# Altium project Ixora.PrjPCB (part 2 of 3)

## Sheet RGB_Display.SchDoc: Ixora
size A3; Organization: Toradex AG; Address1: Altsagenstrasse 5; Address2: Horw; Address3: 6048; Address4: Switzerland; DocumentNumber: 12; Revision: V1.1; SheetNumber: 12; SheetTotal: 19; PageSetup: Record=PageOptions|CenterHorizontal=True|CenterVertical=True|PrintScale=0.73|XCorrection=1.00|YCorrection=1.00|PrintKind=0|BorderSize=5000000|LeftOffset=0|BottomOffset=0|Orientation=2|PaperLength=1000|PaperWidth=1000|Scale=100|PaperSource=7|PrintQuality=-4|MediaType=1|DitherType=10|PaperKind=A4|PrintScaleMode=1
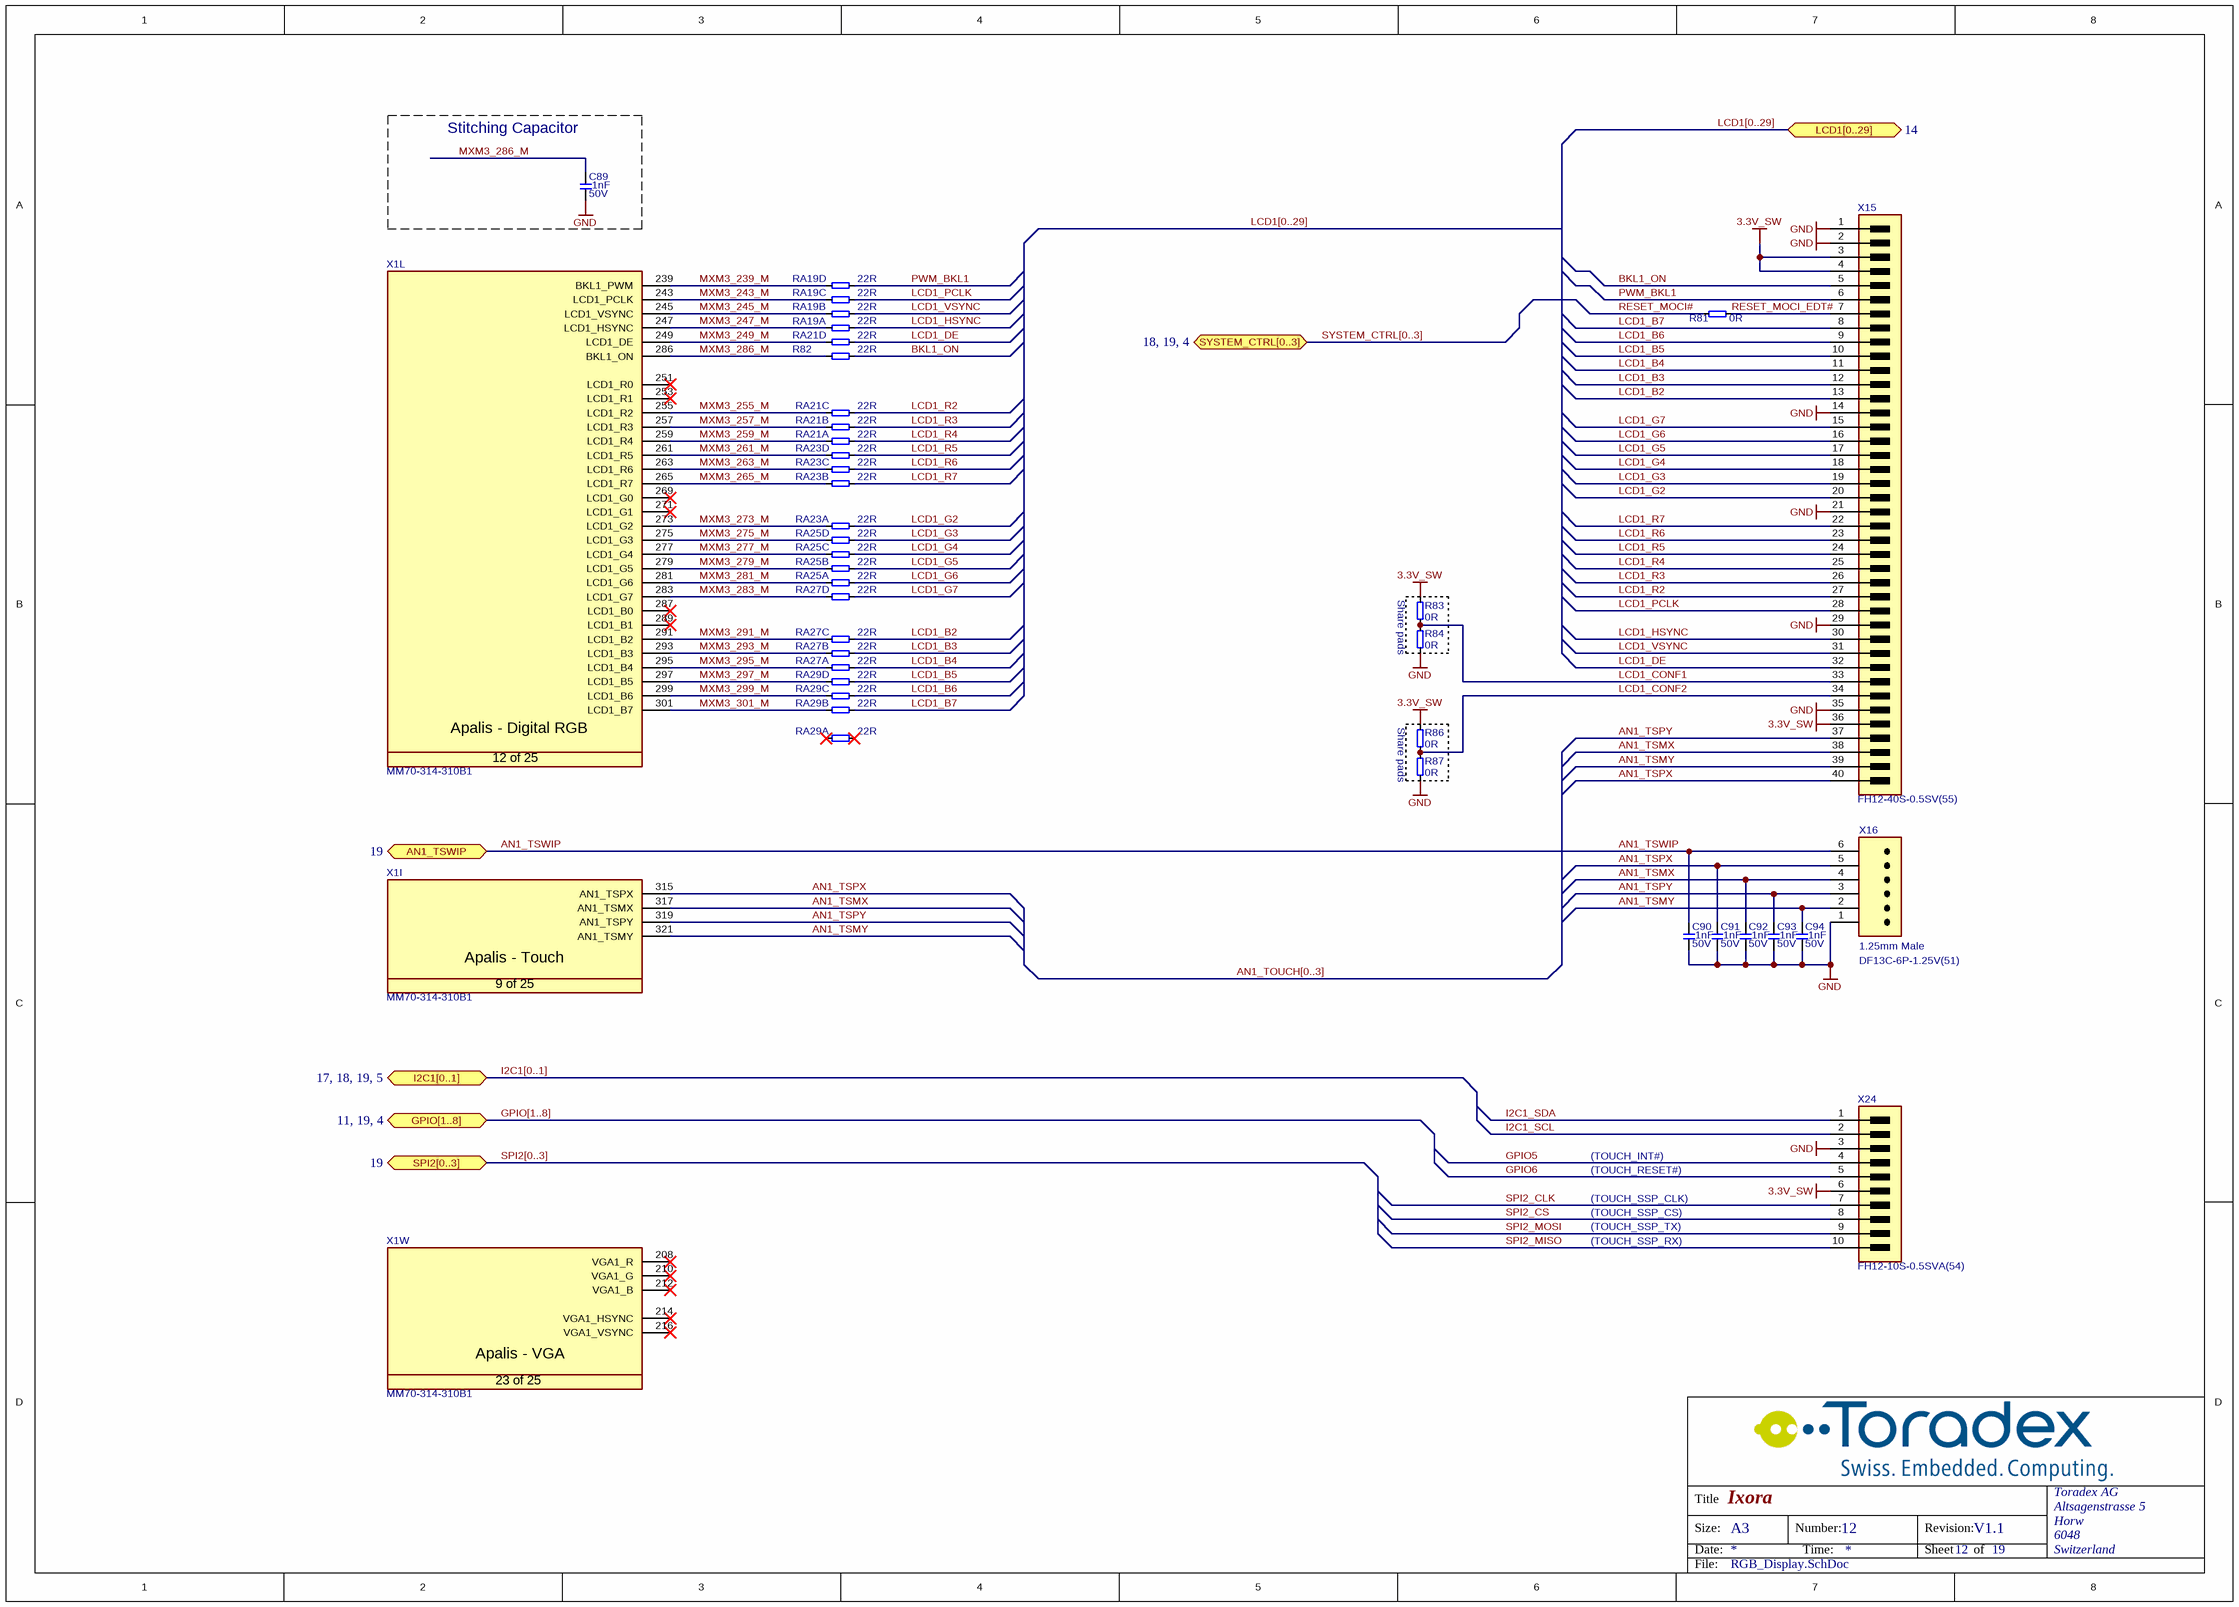
[diagram p7: RGB_Display.SchDoc]

### Parts
C89  Rating: 50V  [CAPC1005X60N]  (hidden comment: 1nF)
C90  Rating: 50V  [CAPC1005X60N]  (hidden comment: 1nF)
C91  Rating: 50V  [CAPC1005X60N]  (hidden comment: 1nF)
C92  Rating: 50V  [CAPC1005X60N]  (hidden comment: 1nF)
C93  Rating: 50V  [CAPC1005X60N]  (hidden comment: 1nF)
C94  Rating: 50V  [CAPC1005X60N]  (hidden comment: 1nF)
R81  0R  [RESC1005X40N]
R82  22R  [RESC1005X40N]
R83  0R  [T_RESC0603X30N]
R84  0R  [T_RESC0603X30N]
R86  0R  [T_RESC0603X30N]
R87  0R  [T_RESC0603X30N]
RA19  22R  [T_Resistor_Array_X4]  (parts A,B,C,D of 4)
RA21  22R  [T_Resistor_Array_X4]  (parts A,B,C,D of 4)
RA23  22R  [T_Resistor_Array_X4]  (parts A,B,C,D of 4)
RA25  22R  [T_Resistor_Array_X4]  (parts A,B,C,D of 4)
RA27  22R  [T_Resistor_Array_X4]  (parts A,B,C,D of 4)
RA29  22R  [T_Resistor_Array_X4]  (parts A,B,C,D of 4)
X1  Manufacturer Part No.: MM70-314-310B1  [T_JAE_MM70-314-310B1]  (hidden comment: CON-JAE-MM70-314-310B1-314-0.5mm)  (parts I,L,W of 25)
X15  FH12-40S-0.5SV(55)  [T_Hirose_FH12-40S-0.5SV(55)]
X16  DF13C-6P-1.25V(51)  [T_HIROSE_DF13C-6P-1.25V(51)]
X24  FH12-10S-0.5SVA(54)  [T_Hirose_FH12-10S-0.5SVA(54)]

### Blocks framed on the sheet
Stitching Capacitor: C89

### Ports
AN1_TSWIP (bidir, see 19), GPIO[1..8] (bidir, see 11, 19, 4), I2C1[0..1] (bidir, see 17, 18, 19, 5), LCD1[0..29] (bidir, see 14), SPI2[0..3] (bidir, see 19), SYSTEM_CTRL[0..3] (bidir, see 18, 19, 4)

### Nets
3.3V_SW: R83.1 R86.1 X15.3(VCC) X15.4(VCC) X15.36(VDD) X24.6(TMDS_DATA0_N)
GND: C89.1 C90.1 C91.1 C92.1 C93.1 C94.1 R84.2 R87.1 X15.1(VSS) X15.2(VSS) X15.14(VSS) X15.21(VSS) X15.29(VSS) X15.35(VSS) X16.1(GND) X24.3(TMDS_CLK_N)
AN1_TSMX: C92.2 X1.317(AN1_TSMX) X15.38(XR) X16.4(TSMX)
AN1_TSMY: C94.2 X1.321(AN1_TSMY) X15.39(YD) X16.2(TSMY)
AN1_TSPX: C91.2 X1.315(AN1_TSPX) X15.40(XL) X16.5(TSPX)
AN1_TSPY: C93.2 X1.319(AN1_TSPY) X15.37(YU) X16.3(TSPY)
AN1_TSWIP: C90.2 X16.6(WIPER) ; port AN1_TSWIP
BKL1_ON: R82.2 X15.5(PWCTRL)
GPIO5: X24.4(GND)
GPIO6: X24.5(TMDS_DATA0_P)
I2C1_SCL: X24.2(TMDS_CLK_P)
I2C1_SDA: X24.1(GND)
LCD1_B2: RA27.7 X15.13(B0)
LCD1_B3: RA27.6 X15.12(B1)
LCD1_B4: RA27.5 X15.11(B2)
LCD1_B5: RA29.8 X15.10(B3)
LCD1_B6: RA29.7 X15.9(B4)
LCD1_B7: RA29.6 X15.8(B5)
LCD1_CONF1: R83.2 R84.1 X15.33(NC)
LCD1_CONF2: R86.2 R87.2 X15.34(SHUT)
LCD1_DE: RA21.8 X15.32(ENB)
LCD1_G2: RA23.5 X15.20(G0)
LCD1_G3: RA25.8 X15.19(G1)
LCD1_G4: RA25.7 X15.18(G2)
LCD1_G5: RA25.6 X15.17(G3)
LCD1_G6: RA25.5 X15.16(G4)
LCD1_G7: RA27.8 X15.15(G5)
LCD1_HSYNC: RA19.5 X15.30(HSYNC)
LCD1_PCLK: RA19.7 X15.28(DCLK)
LCD1_R2: RA21.7 X15.27(R0)
LCD1_R3: RA21.6 X15.26(R1)
LCD1_R4: RA21.5 X15.25(R2)
LCD1_R5: RA23.8 X15.24(R3)
LCD1_R6: RA23.7 X15.23(R4)
LCD1_R7: RA23.6 X15.22(R5)
LCD1_VSYNC: RA19.6 X15.31(VSYNC)
MXM3_239_M: RA19.4 X1.239(BKL1_PWM)
MXM3_243_M: RA19.3 X1.243(LCD1_PCLK)
MXM3_245_M: RA19.2 X1.245(LCD1_VSYNC)
MXM3_247_M: RA19.1 X1.247(LCD1_HSYNC)
MXM3_249_M: RA21.4 X1.249(LCD1_DE)
MXM3_255_M: RA21.3 X1.255(LCD1_R2)
MXM3_257_M: RA21.2 X1.257(LCD1_R3)
MXM3_259_M: RA21.1 X1.259(LCD1_R4)
MXM3_261_M: RA23.4 X1.261(LCD1_R5)
MXM3_263_M: RA23.3 X1.263(LCD1_R6)
MXM3_265_M: RA23.2 X1.265(LCD1_R7)
MXM3_273_M: RA23.1 X1.273(LCD1_G2)
MXM3_275_M: RA25.4 X1.275(LCD1_G3)
MXM3_277_M: RA25.3 X1.277(LCD1_G4)
MXM3_279_M: RA25.2 X1.279(LCD1_G5)
MXM3_281_M: RA25.1 X1.281(LCD1_G6)
MXM3_283_M: RA27.4 X1.283(LCD1_G7)
MXM3_286_M: C89.2 R82.1 X1.286(BKL1_ON)
MXM3_291_M: RA27.3 X1.291(LCD1_B2)
MXM3_293_M: RA27.2 X1.293(LCD1_B3)
MXM3_295_M: RA27.1 X1.295(LCD1_B4)
MXM3_297_M: RA29.4 X1.297(LCD1_B5)
MXM3_299_M: RA29.3 X1.299(LCD1_B6)
MXM3_301_M: RA29.2 X1.301(LCD1_B7)
PWM_BKL1: RA19.8 X15.6(LEDCTRL)
RESET_MOCI#: R81.1
RESET_MOCI_EDT#: R81.2 X15.7(RESET#)
SPI2_CLK: X24.7(GND)
SPI2_CS: X24.8(TMDS_DATA1_P)
SPI2_MISO: X24.10(GND)
SPI2_MOSI: X24.9(TMDS_DATA1_N)

Not connected (* = marked no-connect by the designer): RA29 1* 5*; X1 208(VGA1_R)* 210(VGA1_G)* 212(VGA1_B)* 214(VGA1_HSYNC)* 216(VGA1_VSYNC)* 251(LCD1_R0)* 253(LCD1_R1)* 269(LCD1_G0)* 271(LCD1_G1)* 287(LCD1_B0)* 289(LCD1_B1)*

### Buses and harness runs
bus AN1_TOUCH[0..3]
bus GPIO[1..8] = port GPIO[1..8]
bus I2C1[0..1] = port I2C1[0..1]
bus LCD1[0..29] = port LCD1[0..29]
bus SPI2[0..3] = port SPI2[0..3]
bus SYSTEM_CTRL[0..3] = port SYSTEM_CTRL[0..3]

### Notes on the sheet
- Share pads
- (near X16) 1.25mm Male
- (TOUCH_INT#)
- (TOUCH_RESET#)
- (TOUCH_SSP_CLK)
- (TOUCH_SSP_CS)
- (TOUCH_SSP_TX)
- (TOUCH_SSP_RX)
- Title
- Size:
- Date:
- A3
- Number:
- Time:
- Revision:
- Sheet
- of
- File:
- (in symbol CON-JAE-MM70-314-310B1-314-0.5mm, part I) Apalis - Touch; 9 of 25
- (in symbol CON-JAE-MM70-314-310B1-314-0.5mm, part L) Apalis - Digital RGB; 12 of 25
- (in symbol CON-JAE-MM70-314-310B1-314-0.5mm, part W) Apalis - VGA; 23 of 25

### Library data of the parts
C89-C94 = C-X7R-1nF-50V-10%-0402: Capacitor Ceramic X7R 1nF 50V 10% 0402; Tolerance: 10%; Type: X7R; Value: 1nF
R81 = R-0R-63mW-1%-0402: Resistor 0 ohm 63mW 1% 0402; Rating: 63mW; Tolerance: 1%; Value: 0R
R82 = R-22R-63mW-5%-0402: Resistor 22 ohm 63mW 5% 0402; Rating: 63mW; Tolerance: 5%; Value: 22R
R83 R84 R86 R87 = R-0R-63mW-1%-0603: Resistor 0 ohm 63mW 1% 0603; Rating: 63mW; Tolerance: 1%; Value: 0R
RA19 RA21 RA23 RA25 RA27 RA29 = RA-22R-63mW-5%-1206-div: Resistor Array 22 R 63mW 5% 1206; Tolerance: 5%; Power Dissipation: 63mW; Value: 22R
X1 = CON-JAE-MM70-314-310B1-314-0.5mm: as X1 on sheet Audio
X15 = CON-Hirose-FH12-40S-0.5SV(55)-0.5mm: 0.50mm Pitch FFC/FPC Vertical RGB connector; Manufacturer Name: Hirose; No. of ways: 24; Pitch: 0.5mm; Manufacturer Part No.: FH12-40S-0.5SV(55)
X16 = CON-Hirose-DF13C-6P-1.25V(51)-1x6-1.25mm: Touch Connector; Manufacturer Name: Hirose; No. of ways: 1X6; Pitch: 1.25mm; Manufacturer Part No.: DF13C-6P-1.25V(51)
X24 = CON-Hirose-FH12-10S-0.5SVA(54)-0.5mm: FFC/FPC, 1 Sided Contact, 0.50mm Pitch, 10 pins; Manufacturer Name: Hirose; No. of ways: 10; Pitch: 0.5mm; Manufacturer Part No.: FH12-10S-0.5SVA(54)

## Sheet RTC.SchDoc: Ixora
size A3; Organization: Toradex AG; Address1: Altsagenstrasse 5; Address2: Horw; Address3: 6048; Address4: Switzerland; DocumentNumber: 5; Revision: V1.1; SheetNumber: 5; SheetTotal: 19; PageSetup: Record=PageOptions|CenterHorizontal=True|CenterVertical=True|PrintScale=0.73|XCorrection=1.00|YCorrection=1.00|PrintKind=0|BorderSize=5000000|LeftOffset=0|BottomOffset=0|Orientation=2|PaperLength=1000|PaperWidth=1000|Scale=100|PaperSource=7|PrintQuality=-4|MediaType=1|DitherType=10|PaperKind=A4|PrintScaleMode=1
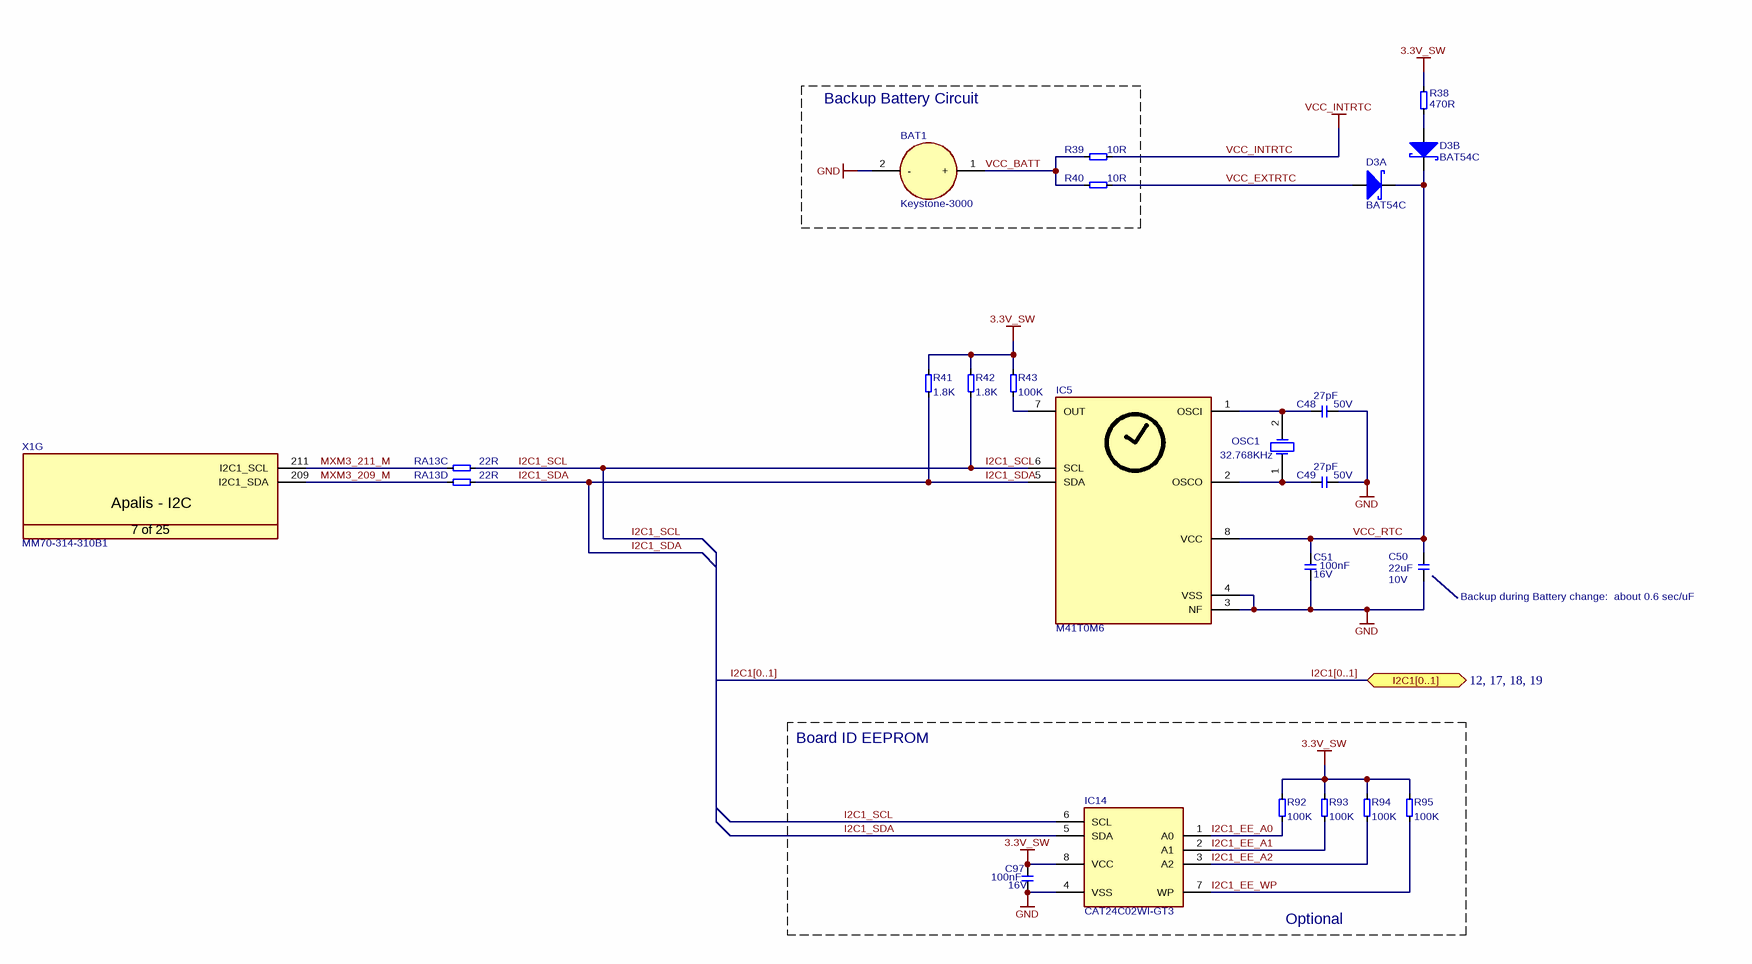
[diagram p8: RTC.SchDoc]

### Parts
BAT1  Keystone-3000  [T_Keystone_3000]
C48  Rating: 50V  [T_CAPC0603X33N]  (hidden comment: 27pF)
C49  Rating: 50V  [T_CAPC0603X33N]  (hidden comment: 27pF)
C50  Rating: 10V  [T_CAPC0805X125N]  (hidden comment: 22uF)
C51  Rating: 16V  [CAPC1005X60N]  (hidden comment: 100nF)
C97  Rating: 16V  [CAPC1005X60N]  (hidden comment: 100nF)
D3  BAT54C  [SOT95P230X110-3N]  (parts A,B of 2)
IC5  M41T0M6  [SOIC127P600X173-8N]
IC14  CAT24C02WI-GT3  [SOIC127P600X173-8N]
OSC1  value 32.768KHz  [T_MC_CC4V-T1A]  (hidden comment: CC4V-T1A)
R38  470R  [RESC1005X40N]
R39  10R  [T_RESC0603X30N]
R40  10R  [T_RESC0603X30N]
R41  1.8K  [RESC1005X40N]
R42  1.8K  [RESC1005X40N]
R43  100K  [RESC1005X40N]
R92  100K  [RESC1005X40N]
R93  100K  [RESC1005X40N]
R94  100K  [RESC1005X40N]
R95  100K  [RESC1005X40N]
RA13  22R  [T_Resistor_Array_X4]  (parts C,D of 4)
X1  Manufacturer Part No.: MM70-314-310B1  [T_JAE_MM70-314-310B1]  (hidden comment: CON-JAE-MM70-314-310B1-314-0.5mm)  (part G of 25)

### Blocks framed on the sheet
Backup Battery Circuit: BAT1 R39 R40

### Ports
I2C1[0..1] (bidir, see 12, 17, 18, 19)

### Nets
3.3V_SW: C97.2 IC14.8(VCC) R38.2 R41.2 R42.2 R43.2 R92.2 R93.2 R94.2 R95.2
GND: BAT1.2(-) C48.2 C49.2 C50.2 C51.1 C97.1 IC5.3(NF) IC5.4(VSS) IC14.4(VSS)
VCC_INTRTC: R39.2
I2C1_EE_A0: IC14.1(A0) R92.1
I2C1_EE_A1: IC14.2(A1) R93.1
I2C1_EE_A2: IC14.3(A2) R94.1
I2C1_EE_WP: IC14.7(WP) R95.1
I2C1_SCL: IC5.6(SCL) IC14.6(SCL) R42.1 RA13.7
I2C1_SDA: IC5.5(SDA) IC14.5(SDA) R41.1 RA13.8
MXM3_209_M: RA13.4 X1.209(I2C1_SDA)
MXM3_211_M: RA13.3 X1.211(I2C1_SCL)
VCC_BATT: BAT1.1(+) R39.1 R40.1
VCC_EXTRTC: D3.1 R40.2
VCC_RTC: C50.1 C51.2 D3.3 IC5.8(VCC)
NetC48_1: C48.1 IC5.1(OSCI) OSC1.2(OSC2)
NetC49_1: C49.1 IC5.2(OSCO) OSC1.1(OSC1)
NetD3_2: D3.2 R38.1
NetIC5_7: IC5.7(OUT) R43.1

### Buses and harness runs
bus I2C1[0..1] = port I2C1[0..1]

### Notes on the sheet
- (near C50) Backup during Battery change:  about 0.6 sec/uF
- Board ID EEPROM
- Optional
- Title
- Size:
- Date:
- A3
- Number:
- Time:
- Revision:
- Sheet
- of
- File:
- (in symbol CON-JAE-MM70-314-310B1-314-0.5mm, part G) Apalis - I2C; 7 of 25

### Library data of the parts
BAT1 = BAT-Keystone-3000: Battery Holder; Manufacturer Part No.: 3000; Manufacturer Name: Keystone
C48 C49 = C-NPO-27pF-50V-5%-0603: Capacitor Ceramic NPO 27pF 50V 5% 0603; Tolerance: 5%; Type: NPO; Value: 27pF
C50 = C-X5R-22uF-10V-20%-0805: Capacitor Ceramic X5R 22uF 10V 20% 0805; Tolerance: 20%; Type: X5R; Value: 22uF
C51 C97 = C-X7R-100nF-16V-10%-0402: Capacitor Ceramic X7R 100nF 16V 10% 0402; Tolerance: 10%; Type: X7R; Value: 100nF
D3 = D-Philips-BAT54C-Schottky-30V-200mA: BAT54 Schottky Diode; Manufacturer: Philips; Manufacturer Part Number: BAT54C
IC5 = IC-ST-M41T0M6: RTC M41T0M6; Manufacturer Name: ST; Manufacturer Part No.: M41T0M6
IC14 = IC-ON-CAT24C02WI-GT3: 2K I2Cl EEPROM; Manufacturer Name: ON Semiconductor; Manufacturer Part No.: CAT24C02WI-GT3
OSC1 = OSC-MC-CC4V-T1A-32.768KHz-30ppm-5x1.9mm: Quartz 32.768kHz; Manufacturer Name: Micro Crystal; Tolerance: 30ppm; Manufacturer Part No.: CC4V-T1A
R38 = R-470R-63mW-5%-0402: Resistor 470 ohm 63mW 5% 0402; Rating: 63mW; Tolerance: 5%; Value: 470R
R39 R40 = R-10R-63mW-5%-0603: Resistor 10 ohm 63mW 5% 0603; Rating: 63mW; Tolerance: 5%; Value: 10R
R41 R42 = R-1.8KR-63mW-5%-0402: Resistor 1.8 Kohm 63mW 5% 0402; Value: 1.8KR; Rating: 63mW; Tolerance: 5%
R43 R92-R95 = R-100KR-63mW-5%-0402: Resistor 100 Kohm 63mW 5% 0402; Value: 100KR; Rating: 63mW; Tolerance: 5%
RA13 = RA-22R-63mW-5%-1206-div: Resistor Array 22 R 63mW 5% 1206; Tolerance: 5%; Power Dissipation: 63mW; Value: 22R
X1 = CON-JAE-MM70-314-310B1-314-0.5mm: MXM3 Connector; Manufacturer Name: JAE; No. of ways: 314

## Sheet Sata.SCHDOC: Ixora
size A3; Organization: Toradex AG; Address1: Altsagenstrasse 5; Address2: Horw; Address3: 6048; Address4: Switzerland; DocumentNumber: 17; Revision: V1.1; SheetNumber: 17; SheetTotal: 19; PageSetup: Record=PageOptions|CenterHorizontal=True|CenterVertical=True|PrintScale=0.73|XCorrection=1.00|YCorrection=1.00|PrintKind=0|BorderSize=5000000|LeftOffset=0|BottomOffset=0|Orientation=2|PaperLength=1000|PaperWidth=1000|Scale=100|PaperSource=7|PrintQuality=-4|MediaType=1|DitherType=10|PaperKind=A4|PrintScaleMode=1
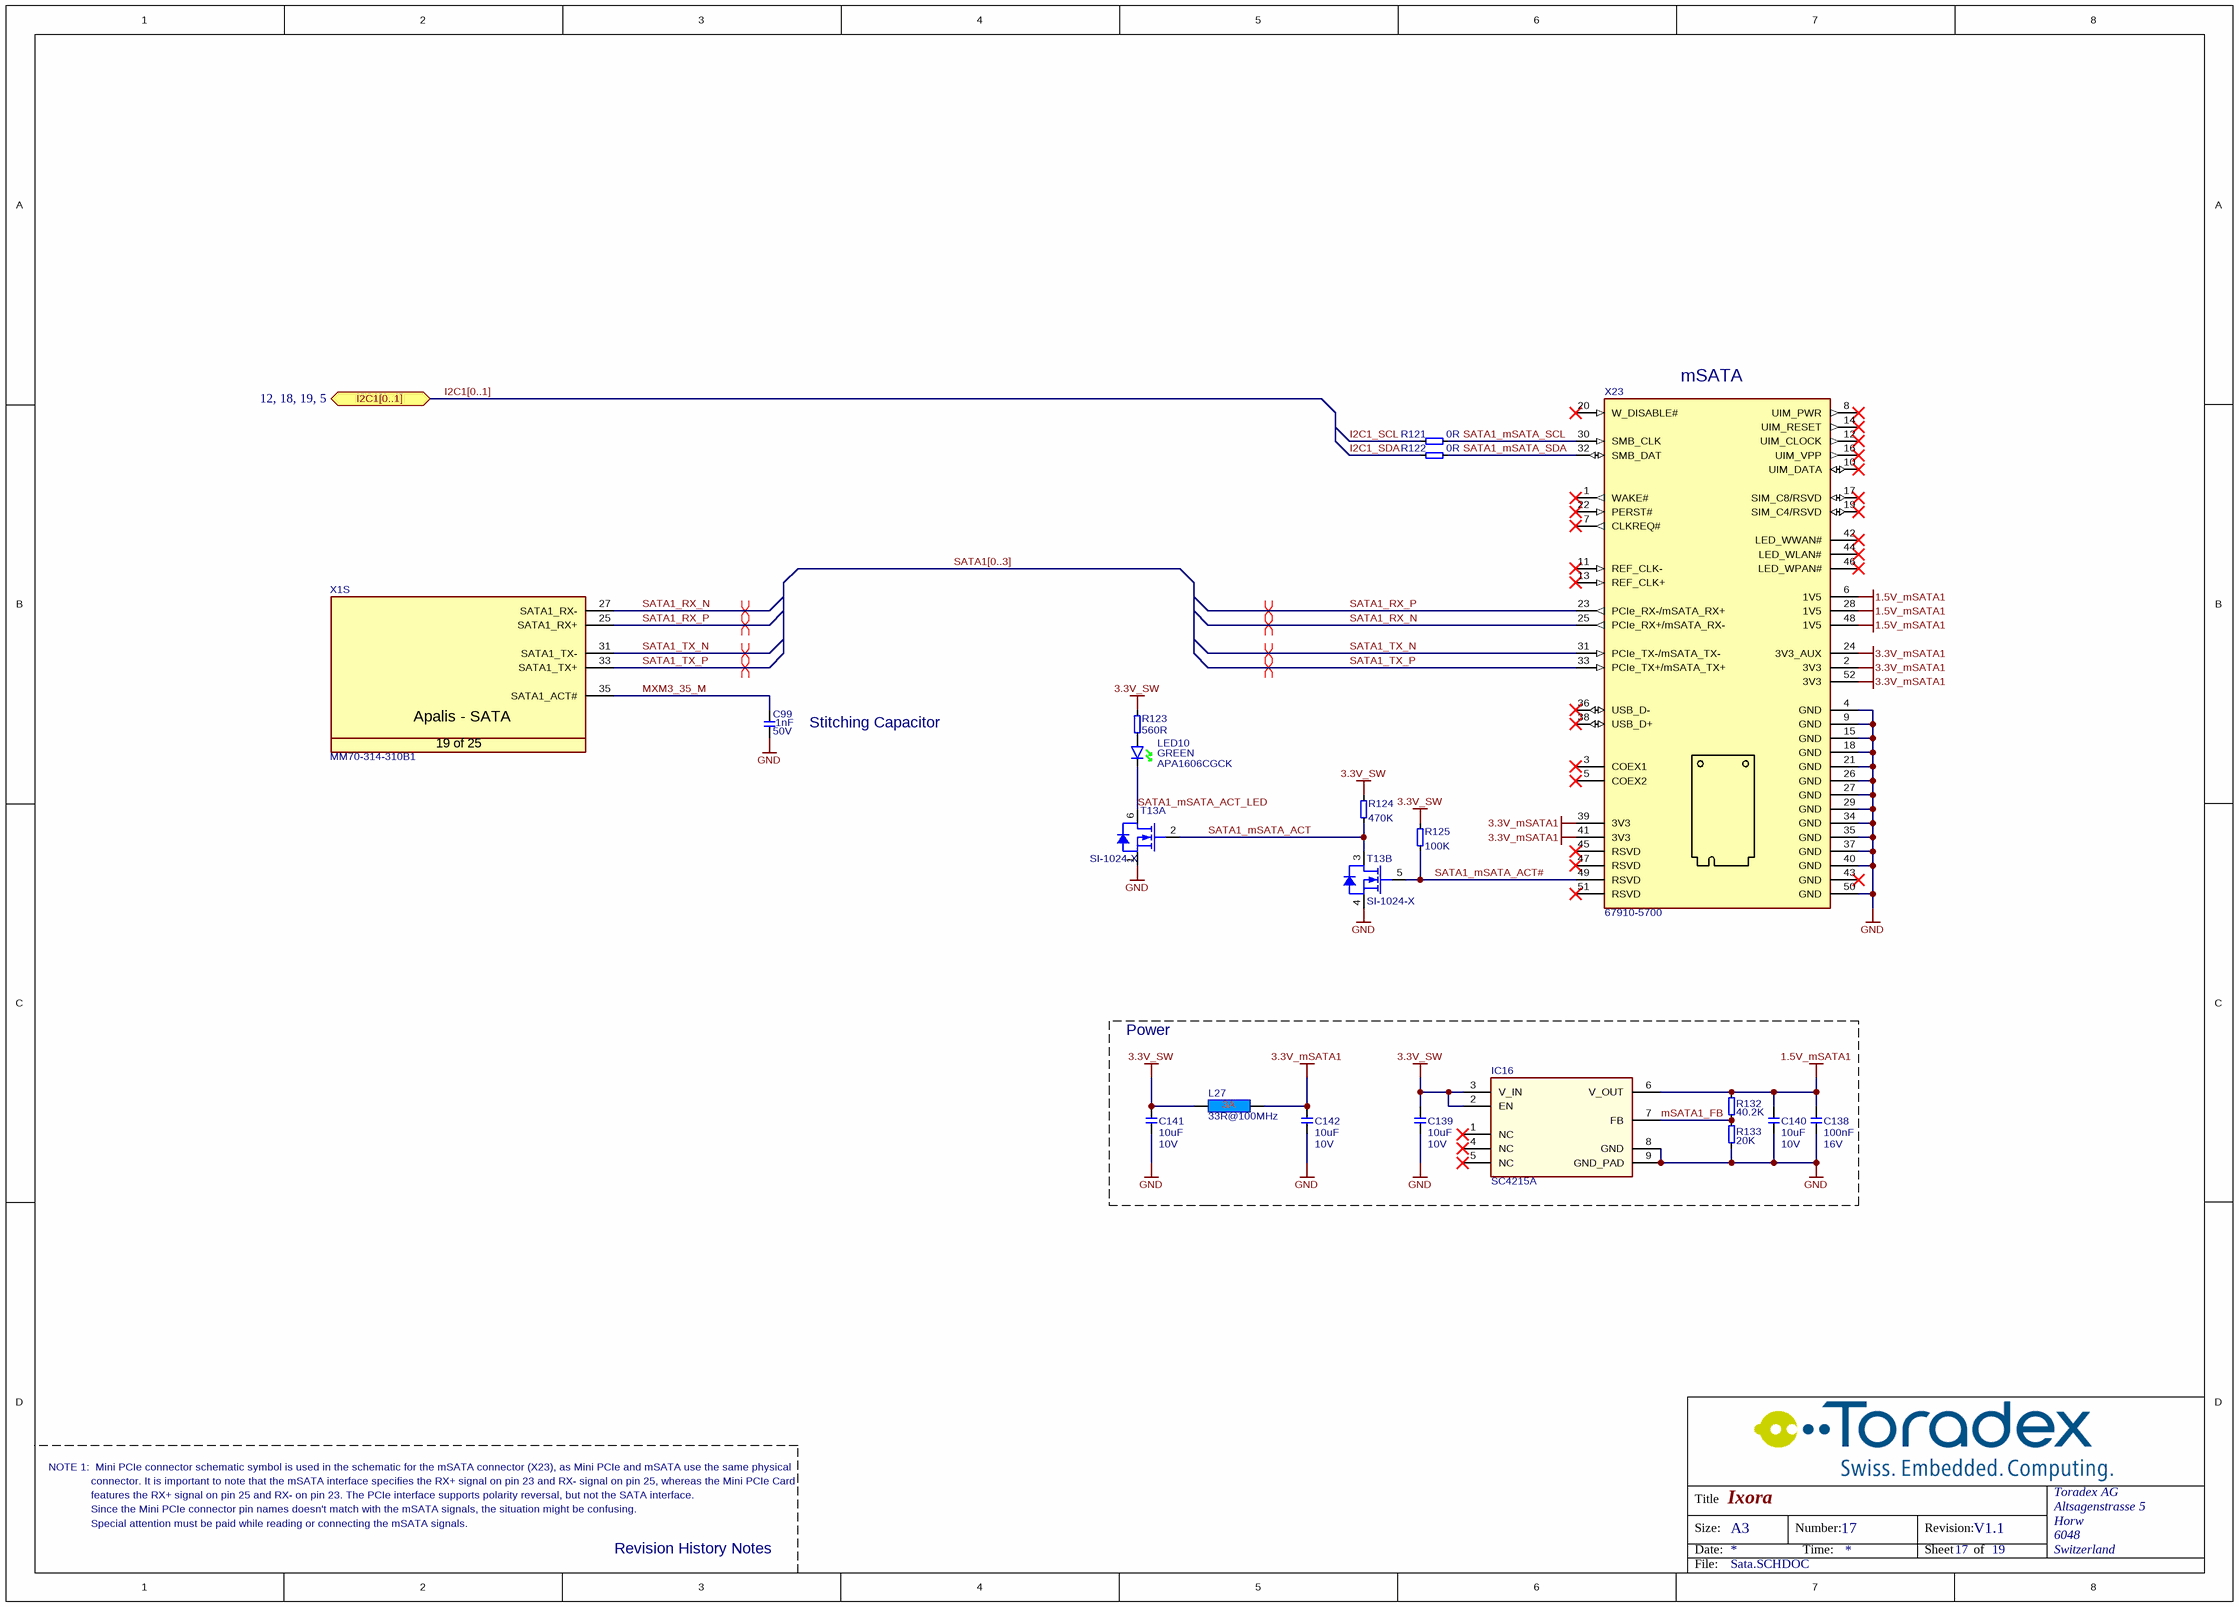
[diagram p9: Sata.SCHDOC]

### Parts
C99  Rating: 50V  [CAPC1005X60N]  (hidden comment: 1nF)
C138  Rating: 16V  [CAPC1005X60N]  (hidden comment: 100nF)
C139  Rating: 10V  [T_CAPC0603X33N]  (hidden comment: 10uF)
C140  Rating: 10V  [T_CAPC0603X33N]  (hidden comment: 10uF)
C141  Rating: 10V  [T_CAPC0603X33N]  (hidden comment: 10uF)
C142  Rating: 10V  [T_CAPC0603X33N]  (hidden comment: 10uF)
IC16  Manufacturer Part No.: SC4215A  [SOIC127P650X175_HS-8N]  (hidden comment: IC-Semtech-SC4215A)
L27  33R@100MHz  [INDC1608X95N]
LED10  Color: GREEN  [T_Kingbright_APA1606CGCK]  (hidden comment: APA1606CGCK)
R121  0R  [RESC1005X40N]
R122  0R  [RESC1005X40N]
R123  560R  [RESC1005X40N]
R124  470K  [RESC1005X40N]
R125  100K  [RESC1005X40N]
R132  40.2K  [RESC1005X40N]
R133  20K  [RESC1005X40N]
T13  Manufacturer Part No.: SI-1024-X  [SOTFL50P160X60-6N]  (hidden comment: T-Vishay-SI-1024X-N)  (parts A,B of 2)
X1  Manufacturer Part No.: MM70-314-310B1  [T_JAE_MM70-314-310B1]  (hidden comment: CON-JAE-MM70-314-310B1-314-0.5mm)  (part S of 25)
X23  67910-5700  [T_Molex_67910-5700]

### Blocks framed on the sheet
Power: C138-C142 IC16 L27 R132 R133

### Ports
I2C1[0..1] (bidir, see 12, 18, 19, 5)

### Nets
1.5V_mSATA1: C138.2 C140.2 IC16.6(V_OUT) R132.2 X23.6(1V5) X23.28(1V5) X23.48(1V5)
3.3V_mSATA1: C142.2 L27.2 X23.2(3V3) X23.24(3V3_AUX) X23.39(3V3) X23.41(3V3) X23.52(3V3)
3.3V_SW: C139.2 C141.2 IC16.2(EN) IC16.3(V_IN) L27.1 R123.1 R124.1 R125.2
GND: C99.1 C138.1 C139.1 C140.1 C141.1 C142.1 IC16.8(GND) IC16.9(GND_PAD) R133.1 T13.1(S) T13.4(S) X23.4(GND) X23.9(GND) X23.15(GND) X23.18(GND) X23.21(GND) X23.26(GND) X23.27(GND) X23.29(GND) X23.34(GND) X23.35(GND) X23.37(GND) X23.40(GND) X23.50(GND)
I2C1_SCL: R121.1
I2C1_SDA: R122.1
mSATA1_FB: IC16.7(FB) R132.1 R133.2
MXM3_35_M: C99.2 X1.35(SATA1_ACT#)
SATA1_mSATA_ACT: R124.2 T13.2(G) T13.3(D)
SATA1_mSATA_ACT#: R125.1 T13.5(G) X23.49(RSVD)
SATA1_mSATA_ACT_LED: LED10.1(K) T13.6(D)
SATA1_mSATA_SCL: R121.2 X23.30(SMB_CLK)
SATA1_mSATA_SDA: R122.2 X23.32(SMB_DAT)
SATA1_RX_N: X1.27(SATA1_RX-) X23.25(PCIe_RX+/mSATA_RX-)
SATA1_RX_P: X1.25(SATA1_RX+) X23.23(PCIe_RX-/mSATA_RX+)
SATA1_TX_N: X1.31(SATA1_TX-) X23.31(PCIe_TX-/mSATA_TX-)
SATA1_TX_P: X1.33(SATA1_TX+) X23.33(PCIe_TX+/mSATA_TX+)
NetLED10_2: LED10.2(A) R123.2

Not connected (* = marked no-connect by the designer): IC16 1(NC)* 4(NC)* 5(NC)*; X23 1(WAKE#)* 3(COEX1)* 5(COEX2)* 7(CLKREQ#)* 8(UIM_PWR)* 10(UIM_DATA)* 11(REF_CLK-)* 12(UIM_CLOCK)* 13(REF_CLK+)* 14(UIM_RESET)* 16(UIM_VPP)* 17(SIM_C8/RSVD)* 19(SIM_C4/RSVD)* 20(W_DISABLE#)* 22(PERST#)* 36(USB_D-)* 38(USB_D+)* 42(LED_WWAN#)* 43(GND)* 44(LED_WLAN#)* 45(RSVD)* 46(LED_WPAN#)* 47(RSVD)* 51(RSVD)*

### Buses and harness runs
bus I2C1[0..1] = port I2C1[0..1]
bus SATA1[0..3]

### Layout directives
differential pair: SATA1_RX_N, SATA1_RX_P, SATA1_TX_N, SATA1_TX_P

### Notes on the sheet
- (near X23) mSATA
- (near C99) Stitching Capacitor
- NOTE 1:  Mini PCIe connector schematic symbol is used in the schematic for the mSATA connector (X23), as Mini PCIe and mSATA use the same physical
- connector. It is important to note that the mSATA interface specifies the RX+ signal on pin 23 and RX- signal on pin 25, whereas the Mini PCIe Card
- Since the Mini PCIe connector pin names doesn't match with the mSATA signals, the situation might be confusing.
- features the RX+ signal on pin 25 and RX- on pin 23. The PCIe interface supports polarity reversal, but not the SATA interface.
- Special attention must be paid while reading or connecting the mSATA signals.
- Revision History Notes
- Title
- Size:
- Date:
- A3
- Number:
- Time:
- Revision:
- Sheet
- of
- File:
- (in symbol CON-JAE-MM70-314-310B1-314-0.5mm, part S) Apalis - SATA; 19 of 25

### Library data of the parts
C99 = C-X7R-1nF-50V-10%-0402: Capacitor Ceramic X7R 1nF 50V 10% 0402; Tolerance: 10%; Type: X7R; Value: 1nF
C138 = C-X7R-100nF-16V-10%-0402: Capacitor Ceramic X7R 100nF 16V 10% 0402; Tolerance: 10%; Type: X7R; Value: 100nF
C139-C142 = C-X5R-10uF-10V-20%-0603: Capacitor Ceramic X5R 10uF 10V 20% 0603; Tolerance: 20%; Type: X5R; Value: 10uF
IC16 = IC-Semtech-SC4215A: LDO TO 2A; Manufacturer Name: Semtech
L27 = L-33R@100MHz-3A-25%-0603: 33R@100MHz 3A EMI FILTER; Tolerance: 25%; Rating: 3A; Value: 33R@100MHz
LED10 = LED-Kingbright-APA1606CGCK: LED green Kingbright APA1606CGCK; Manufacturer Name: Kingbright; Manufacturer Part No.: APA1606CGCK
R121 R122 = R-0R-63mW-1%-0402: Resistor 0 ohm 63mW 1% 0402; Rating: 63mW; Tolerance: 1%; Value: 0R
R123 = R-560R-63mW-5%-0402: Resistor 560 ohm 63mW 5% 0402; Rating: 63mW; Tolerance: 5%; Value: 560R
R124 = R-470KR-63mW-5%-0402: Resistor 470 Kohm 63mW 5% 0402; Value: 470KR; Rating: 63mW; Tolerance: 5%
R125 = R-100KR-63mW-5%-0402: as R43 on sheet RTC; Rating: 63mW; Tolerance: 5%
R132 = R-40.2KR-63mW-1%-0402: Resistor 40.2 Kohm 63mW 1% 0402; Value: 40.2KR; Rating: 63mW; Tolerance: 1%
R133 = R-20KR-63mW-1%-0402: Resistor 20 Kohm 63mW 1% 0402; Value: 20KR; Rating: 63mW; Tolerance: 1%
T13 = T-Vishay-SI-1024X-N: Dual N-Channel 20V (D-S)  MOSFET; Manufacturer Name: Vishay
X1 = CON-JAE-MM70-314-310B1-314-0.5mm: as X1 on sheet RTC
X23 = CON-Molex-67910-5700: PCIe_Mini Card Holder; Manufacturer Name: Molex; Part No.: 67910-5700

## Sheet SDCard.SchDoc: Ixora
size A3; Organization: Toradex AG; Address1: Altsagenstrasse 5; Address2: Horw; Address3: 6048; Address4: Switzerland; DocumentNumber: 8; Revision: V1.1; SheetNumber: 8; SheetTotal: 19; PageSetup: Record=PageOptions|CenterHorizontal=True|CenterVertical=True|PrintScale=0.71|XCorrection=1.00|YCorrection=1.00|PrintKind=0|BorderSize=5000000|LeftOffset=0|BottomOffset=0|Orientation=2|PaperLength=1000|PaperWidth=1000|Scale=100|PaperSource=7|PrintQuality=-4|MediaType=1|DitherType=10|PaperKind=A4|PrintScaleMode=1
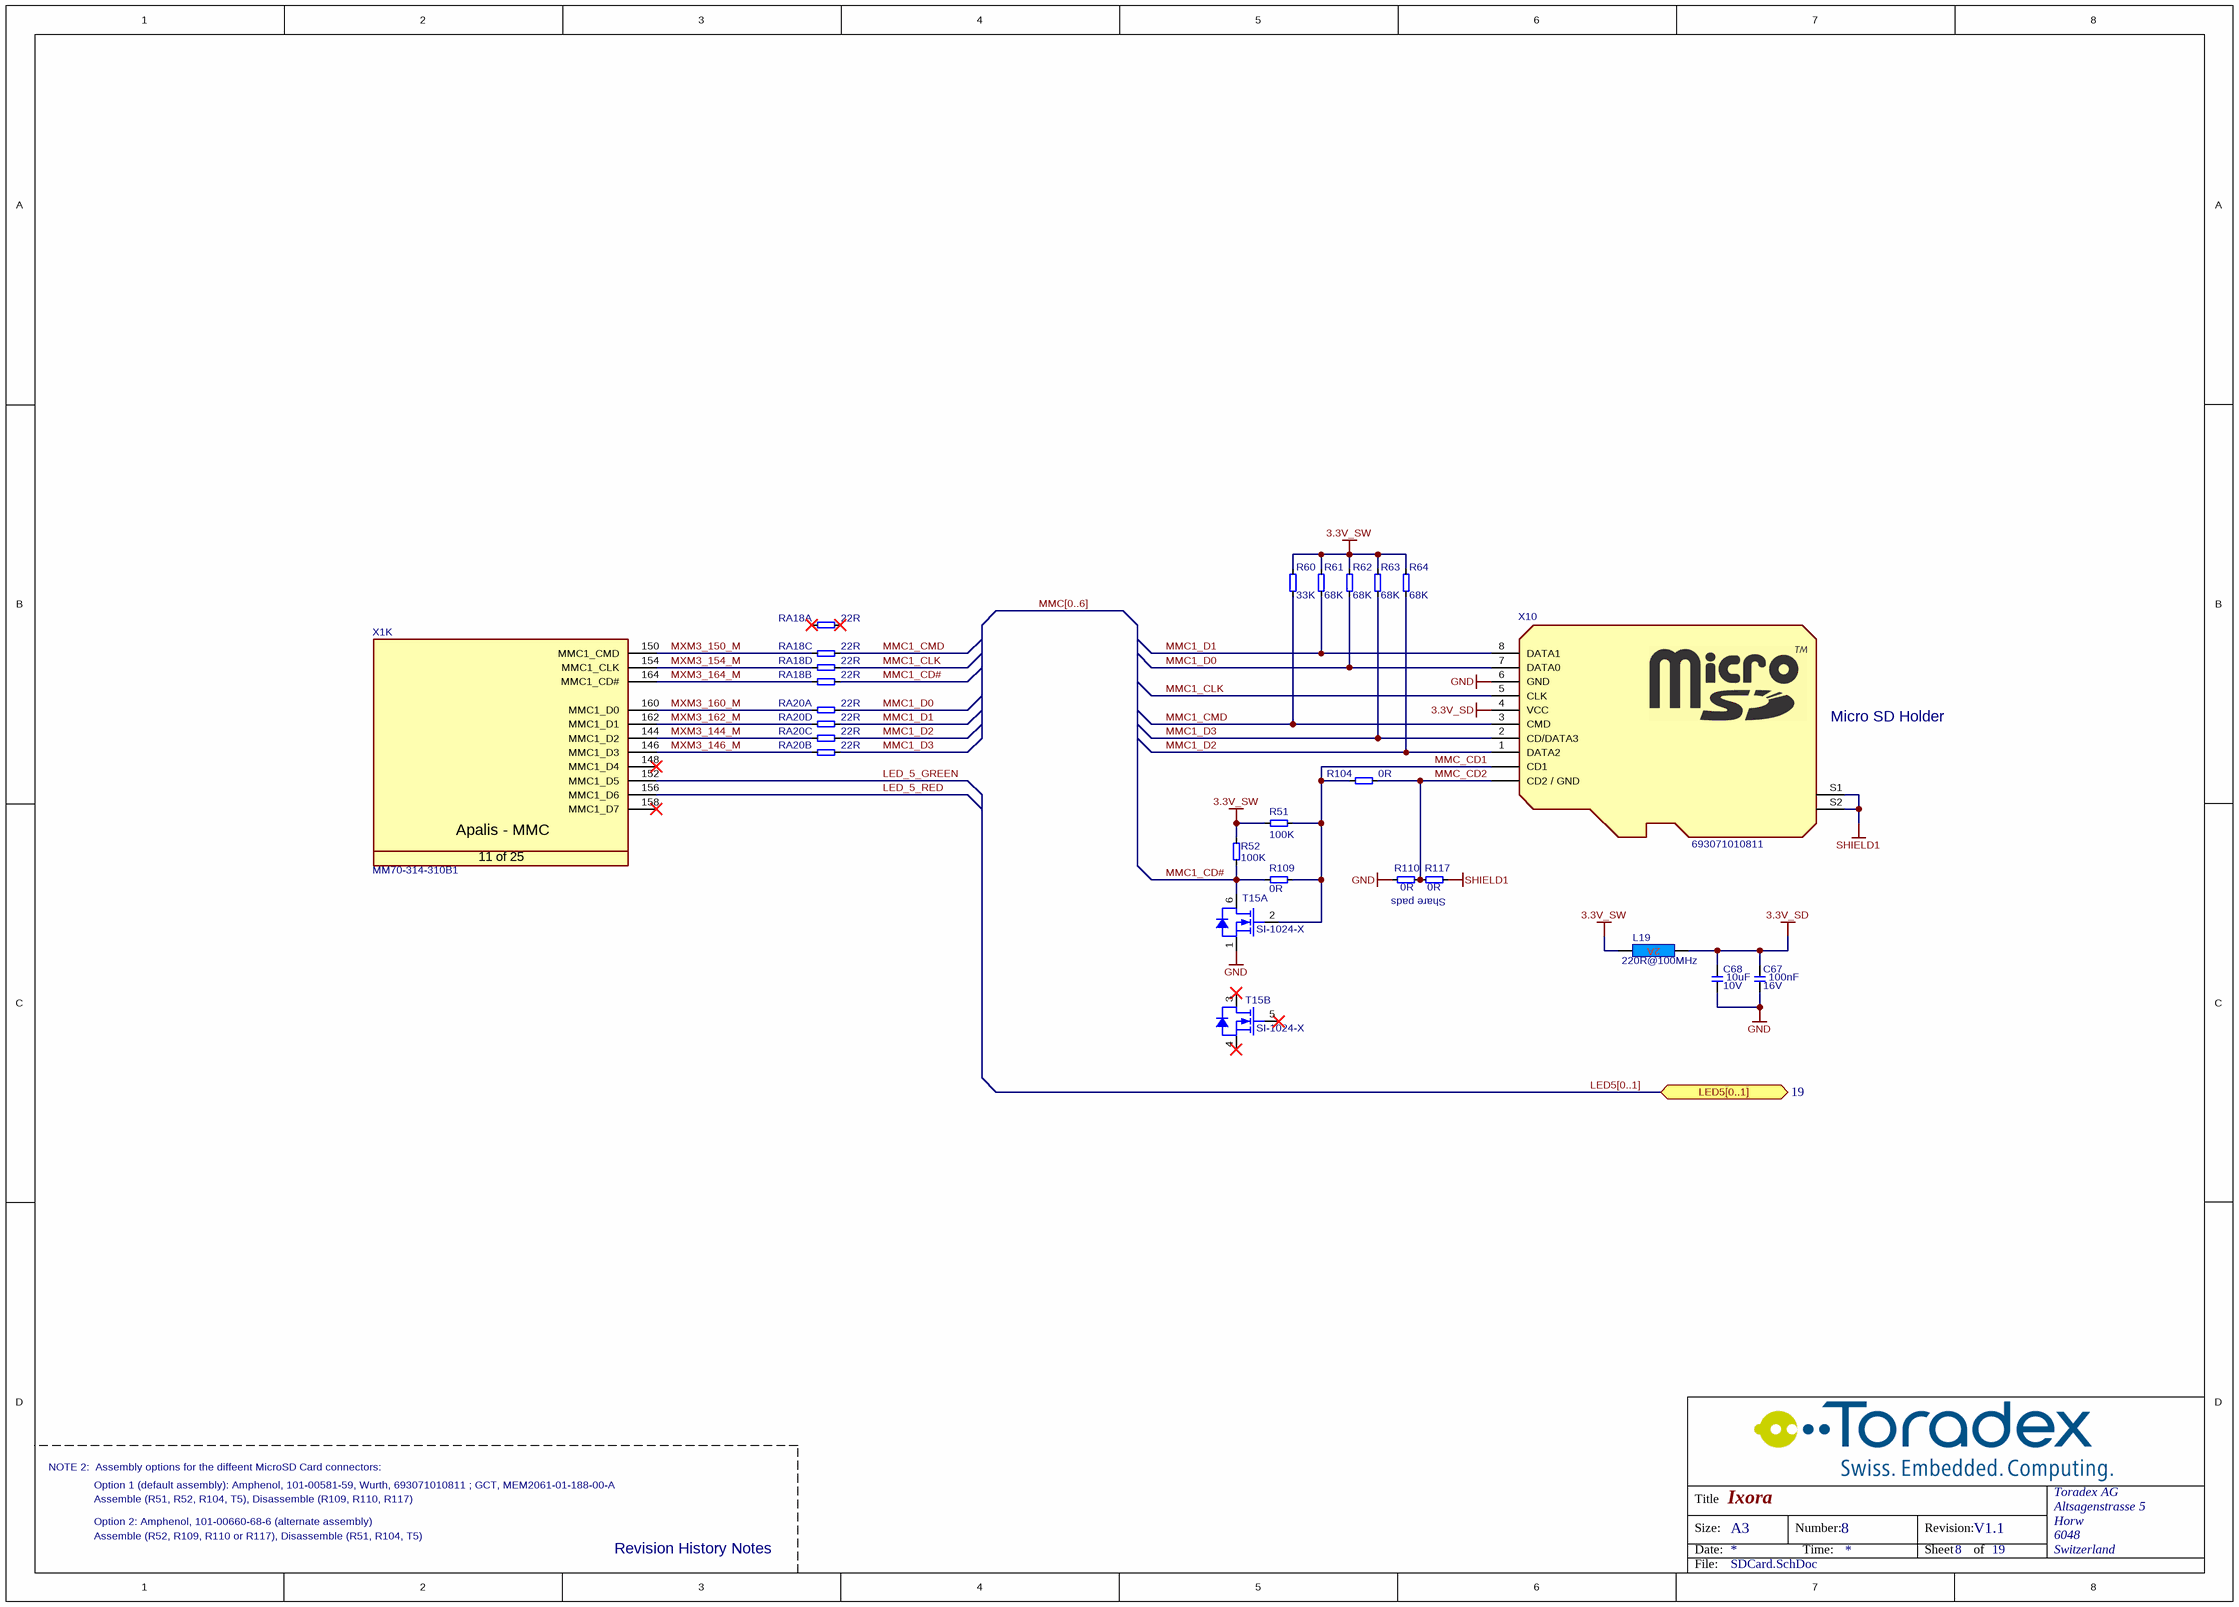
[diagram p10: SDCard.SchDoc]

### Parts
C67  Rating: 16V  [CAPC1005X60N]  (hidden comment: 100nF)
C68  Rating: 10V  [T_CAPC0603X33N]  (hidden comment: 10uF)
L19  220R@100MHz  [INDC1608X95N]
R51  100K  [RESC1005X40N]
R52  100K  [RESC1005X40N]
R60  33K  [RESC1005X40N]
R61  68K  [RESC1005X40N]
R62  68K  [RESC1005X40N]
R63  68K  [RESC1005X40N]
R64  68K  [RESC1005X40N]
R104  0R  [RESC1005X40N]
R109  0R  [RESC1005X40N]
R110  0R  [RESC1005X40N]
R117  0R  [RESC1005X40N]
RA18  22R  [T_Resistor_Array_X4]  (parts A,B,C,D of 4)
RA20  22R  [T_Resistor_Array_X4]  (parts A,B,C,D of 4)
T15  Manufacturer Part No.: SI-1024-X  [SOTFL50P160X60-6N]  (hidden comment: T-Vishay-SI-1024X-N)  (parts A,B of 2)
X1  Manufacturer Part No.: MM70-314-310B1  [T_JAE_MM70-314-310B1]  (hidden comment: CON-JAE-MM70-314-310B1-314-0.5mm)  (part K of 25)
X10  Manufacturer Part No.: 693071010811  [T_Wurth_693071010811]  (hidden comment: MicroSD Holder)

### Ports
LED5[0..1] (bidir, see 19)

### Nets
3.3V_SD: C67.2 C68.2 L19.1 X10.4(VCC)
3.3V_SW: L19.2 R51.2 R52.2 R60.2 R61.2 R62.2 R63.2 R64.2
GND: C67.1 C68.1 R110.1 T15.1(S) X10.6(GND)
SHIELD1: R117.2 X10.S1(S) X10.S2(S)
LED_5_GREEN: X1.152(MMC1_D5)
LED_5_RED: X1.156(MMC1_D6)
MMC1_CD#: R52.1 R109.1 RA18.6 T15.6(D)
MMC1_CLK: RA18.8 X10.5(CLK)
MMC1_CMD: R60.1 RA18.7 X10.3(CMD)
MMC1_D0: R62.1 RA20.5 X10.7(DATA0)
MMC1_D1: R61.1 RA20.8 X10.8(DATA1)
MMC1_D2: R64.1 RA20.7 X10.1(DATA2)
MMC1_D3: R63.1 RA20.6 X10.2(CD/DATA3)
MMC_CD1: R51.1 R104.2 R109.2 T15.2(G) X10.CD1
MMC_CD2: R104.1 R110.2 R117.1 X10.CD2(CD2_/_GND)
MXM3_144_M: RA20.3 X1.144(MMC1_D2)
MXM3_146_M: RA20.2 X1.146(MMC1_D3)
MXM3_150_M: RA18.3 X1.150(MMC1_CMD)
MXM3_154_M: RA18.4 X1.154(MMC1_CLK)
MXM3_160_M: RA20.1 X1.160(MMC1_D0)
MXM3_162_M: RA20.4 X1.162(MMC1_D1)
MXM3_164_M: RA18.2 X1.164(MMC1_CD#)

Not connected (* = marked no-connect by the designer): RA18 1* 5*; T15 3(D)* 4(S)* 5(G)*; X1 148(MMC1_D4)* 158(MMC1_D7)*

### Buses and harness runs
bus LED5[0..1] = port LED5[0..1]
bus MMC[0..6]

### Notes on the sheet
- (near X10) Micro SD Holder
- Share pads
- NOTE 2:  Assembly options for the diffeent MicroSD Card connectors:
- Option 1 (default assembly): Amphenol, 101-00581-59, Wurth, 693071010811 ; GCT, MEM2061-01-188-00-A
- Option 2: Amphenol, 101-00660-68-6 (alternate assembly)
- Assemble (R51, R52, R104, T5), Disassemble (R109, R110, R117)
- Assemble (R52, R109, R110 or R117), Disassemble (R51, R104, T5)
- Revision History Notes
- Title
- Size:
- Date:
- A3
- Number:
- Time:
- Revision:
- Sheet
- of
- File:
- (in symbol CON-JAE-MM70-314-310B1-314-0.5mm, part K) Apalis - MMC; 11 of 25

### Library data of the parts
C67 = C-X7R-100nF-16V-10%-0402: Capacitor Ceramic X7R 100nF 16V 10% 0402; Tolerance: 10%; Type: X7R; Value: 100nF
C68 = C-X5R-10uF-10V-20%-0603: Capacitor Ceramic X5R 10uF 10V 20% 0603; Tolerance: 20%; Type: X5R; Value: 10uF
L19 = L-220R@100MHz-2A-25%-0603: 220R@100MHz 2A EMI FILTER; Tolerance: 25%; Rating: 2A; Value: 220R@100MHz
R51 R52 = R-100KR-63mW-5%-0402: as R43 on sheet RTC; Rating: 63mW; Tolerance: 5%
R60 = R-33KR-63mW-5%-0402: Resistor 33 Kohm 63mW 5% 0402; Value: 33KR; Rating: 63mW; Tolerance: 5%
R61-R64 = R-68KR-63mW-5%-0402: Resistor 68 Kohm 63mW 5% 0402; Value: 68KR; Rating: 63mW; Tolerance: 5%
R104 R109 R110 R117 = R-0R-63mW-1%-0402: Resistor 0 ohm 63mW 1% 0402; Rating: 63mW; Tolerance: 1%; Value: 0R
RA18 RA20 = RA-22R-63mW-5%-1206-div: Resistor Array 22 R 63mW 5% 1206; Tolerance: 5%; Power Dissipation: 63mW; Value: 22R
T15 = T-Vishay-SI-1024X-N: as T13 on sheet Sata
X1 = CON-JAE-MM70-314-310B1-314-0.5mm: as X1 on sheet RTC
X10 = CON-Wurth-693071010811: Micro SD Holder Push Push CD; Manufacturer Name: Wurth; No. of ways: 9

## Sheet Serial.SchDoc: Ixora
size A3; Organization: Toradex AG; Address1: Altsagenstrasse 5; Address2: Horw; Address3: 6048; Address4: Switzerland; DocumentNumber: 16; Revision: V1.1; SheetNumber: 16; SheetTotal: 19; PageSetup: Record=PageOptions|CenterHorizontal=True|CenterVertical=True|PrintScale=0.73|XCorrection=1.00|YCorrection=1.00|PrintKind=0|BorderSize=5000000|LeftOffset=0|BottomOffset=0|Orientation=2|PaperLength=1000|PaperWidth=1000|Scale=100|PaperSource=7|PrintQuality=-4|MediaType=1|DitherType=10|PaperKind=A4|PrintScaleMode=1
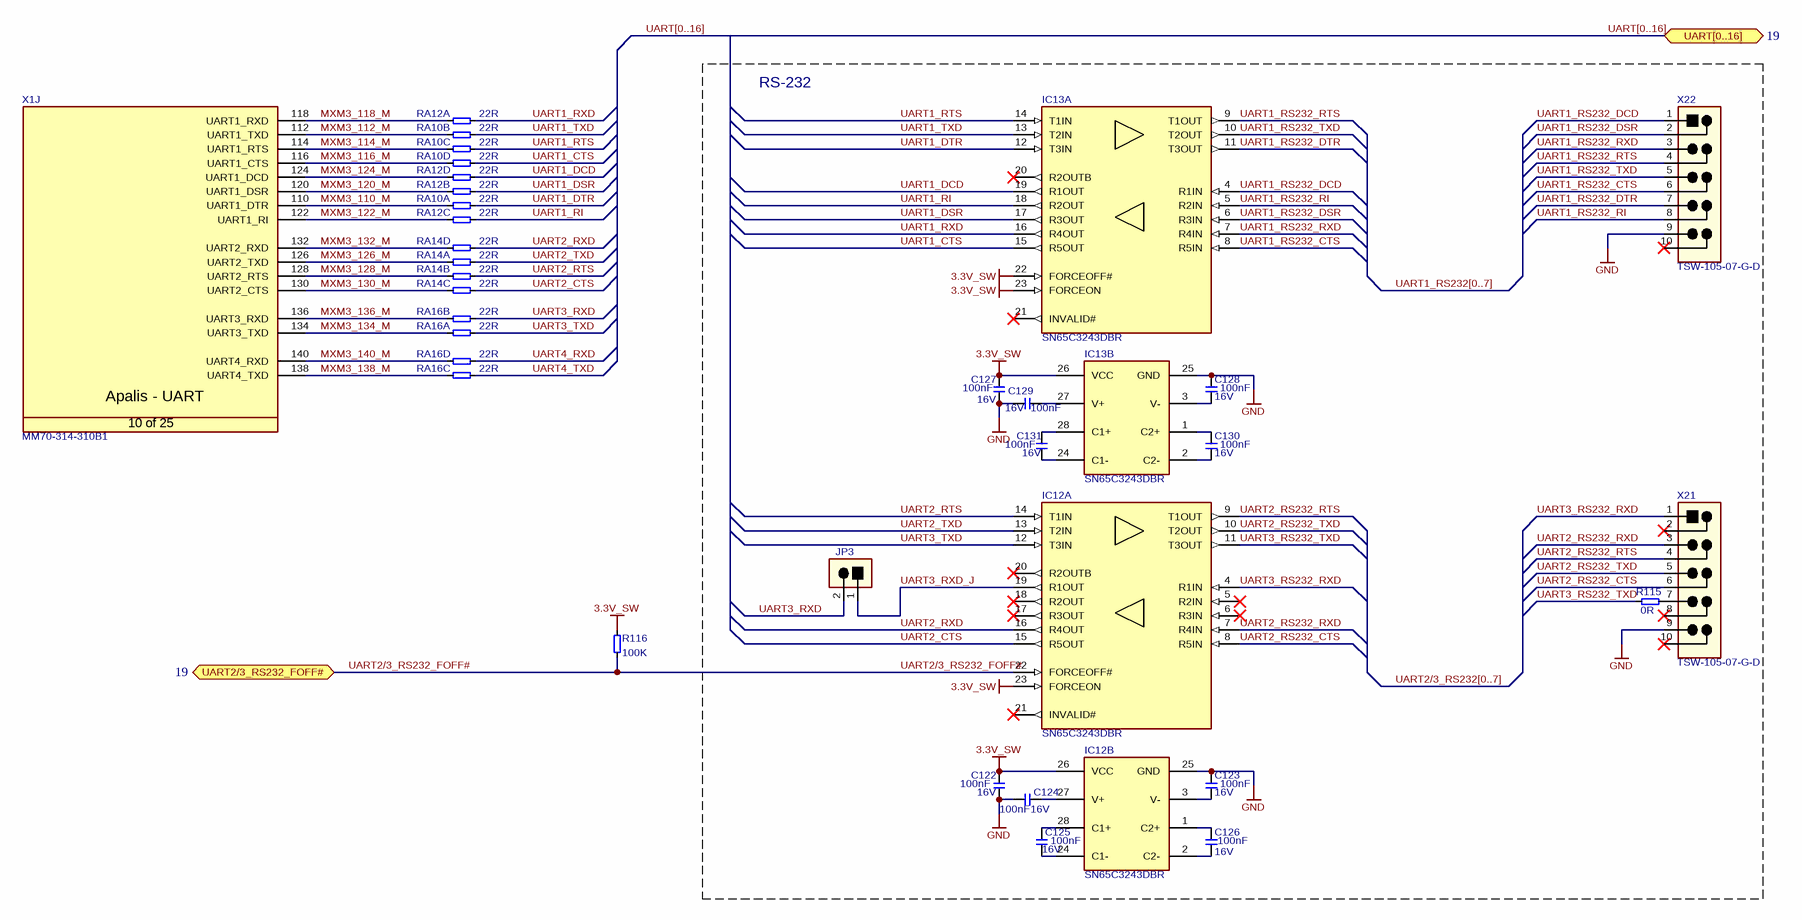
[diagram p11: Serial.SchDoc]

### Parts
C122  Rating: 16V  [CAPC1005X60N]  (hidden comment: 100nF)
C123  Rating: 16V  [CAPC1005X60N]  (hidden comment: 100nF)
C124  Rating: 16V  [CAPC1005X60N]  (hidden comment: 100nF)
C125  Rating: 16V  [CAPC1005X60N]  (hidden comment: 100nF)
C126  Rating: 16V  [CAPC1005X60N]  (hidden comment: 100nF)
C127  Rating: 16V  [CAPC1005X60N]  (hidden comment: 100nF)
C128  Rating: 16V  [CAPC1005X60N]  (hidden comment: 100nF)
C129  Rating: 16V  [CAPC1005X60N]  (hidden comment: 100nF)
C130  Rating: 16V  [CAPC1005X60N]  (hidden comment: 100nF)
C131  Rating: 16V  [CAPC1005X60N]  (hidden comment: 100nF)
IC12  SN65C3243DBR  [SOP65P780X200-28N]  (parts A,B of 2)
IC13  SN65C3243DBR  [SOP65P780X200-28N]  (parts A,B of 2)
JP3  TSW-101-07-G-D  [T_Samtec_TSW-101-07-G-D]  (value not drawn)
R115  0R  [RESC1005X40N]
R116  100K  [RESC1005X40N]
RA10  22R  [T_Resistor_Array_X4]  (parts A,B,C,D of 4)
RA12  22R  [T_Resistor_Array_X4]  (parts A,B,C,D of 4)
RA14  22R  [T_Resistor_Array_X4]  (parts A,B,C,D of 4)
RA16  22R  [T_Resistor_Array_X4]  (parts A,B,C,D of 4)
X1  Manufacturer Part No.: MM70-314-310B1  [T_JAE_MM70-314-310B1]  (hidden comment: CON-JAE-MM70-314-310B1-314-0.5mm)  (part J of 25)
X21  TSW-105-07-G-D  [T_Samtec_TSW-105-07-G-D]
X22  TSW-105-07-G-D  [T_Samtec_TSW-105-07-G-D]

### Blocks framed on the sheet
RS-232: C122-C131 IC12 IC13 JP3 R115 X21 X22

### Ports
UART2/3_RS232_FOFF# (bidir, see 19), UART[0..16] (bidir, see 19)

### Nets
3.3V_SW: C122.2 C127.2 IC12.23(FORCEON) IC12.26(VCC) IC13.22(FORCEOFF#) IC13.23(FORCEON) IC13.26(VCC) R116.2
GND: C122.1 C123.2 C124.1 C127.1 C128.2 C129.1 IC12.25(GND) IC13.25(GND) X21.9 X22.9
MXM3_110_M: RA10.1 X1.110(UART1_DTR)
MXM3_112_M: RA10.2 X1.112(UART1_TXD)
MXM3_114_M: RA10.3 X1.114(UART1_RTS)
MXM3_116_M: RA10.4 X1.116(UART1_CTS)
MXM3_118_M: RA12.1 X1.118(UART1_RXD)
MXM3_120_M: RA12.2 X1.120(UART1_DSR)
MXM3_122_M: RA12.3 X1.122(UART1_RI)
MXM3_124_M: RA12.4 X1.124(UART1_DCD)
MXM3_126_M: RA14.1 X1.126(UART2_TXD)
MXM3_128_M: RA14.2 X1.128(UART2_RTS)
MXM3_130_M: RA14.3 X1.130(UART2_CTS)
MXM3_132_M: RA14.4 X1.132(UART2_RXD)
MXM3_134_M: RA16.1 X1.134(UART3_TXD)
MXM3_136_M: RA16.2 X1.136(UART3_RXD)
MXM3_138_M: RA16.3 X1.138(UART4_TXD)
MXM3_140_M: RA16.4 X1.140(UART4_RXD)
UART1_CTS: IC13.15(R5OUT) RA10.8
UART1_DCD: IC13.19(R1OUT) RA12.8
UART1_DSR: IC13.17(R3OUT) RA12.6
UART1_DTR: IC13.12(T3IN) RA10.5
UART1_RI: IC13.18(R2OUT) RA12.7
UART1_RS232_CTS: IC13.8(R5IN) X22.6
UART1_RS232_DCD: IC13.4(R1IN) X22.1
UART1_RS232_DSR: IC13.6(R3IN) X22.2
UART1_RS232_DTR: IC13.11(T3OUT) X22.7
UART1_RS232_RI: IC13.5(R2IN) X22.8
UART1_RS232_RTS: IC13.9(T1OUT) X22.4
UART1_RS232_RXD: IC13.7(R4IN) X22.3
UART1_RS232_TXD: IC13.10(T2OUT) X22.5
UART1_RTS: IC13.14(T1IN) RA10.7
UART1_RXD: IC13.16(R4OUT) RA12.5
UART1_TXD: IC13.13(T2IN) RA10.6
UART2/3_RS232_FOFF#: IC12.22(FORCEOFF#) R116.1 ; port UART2/3_RS232_FOFF#
UART2_CTS: IC12.15(R5OUT) RA14.7
UART2_RS232_CTS: IC12.8(R5IN) X21.6
UART2_RS232_RTS: IC12.9(T1OUT) X21.4
UART2_RS232_RXD: IC12.7(R4IN) X21.3
UART2_RS232_TXD: IC12.10(T2OUT) X21.5
UART2_RTS: IC12.14(T1IN) RA14.6
UART2_RXD: IC12.16(R4OUT) RA14.8
UART2_TXD: IC12.13(T2IN) RA14.5
UART3_RS232_RXD: IC12.4(R1IN) X21.1
UART3_RS232_TXD: IC12.11(T3OUT) R115.1
UART3_RXD: JP3.2 RA16.6
UART3_RXD_J: IC12.19(R1OUT) JP3.1
UART3_TXD: IC12.12(T3IN) RA16.5
UART4_RXD: RA16.8
UART4_TXD: RA16.7
NetC123_1: C123.1 IC12.3(V-)
NetC124_2: C124.2 IC12.27(V+)
NetC125_1: C125.1 IC12.24(C1-)
NetC125_2: C125.2 IC12.28(C1+)
NetC126_1: C126.1 IC12.2(C2-)
NetC126_2: C126.2 IC12.1(C2+)
NetC128_1: C128.1 IC13.3(V-)
NetC129_2: C129.2 IC13.27(V+)
NetC130_1: C130.1 IC13.2(C2-)
NetC130_2: C130.2 IC13.1(C2+)
NetC131_1: C131.1 IC13.24(C1-)
NetC131_2: C131.2 IC13.28(C1+)
NetR115_2: R115.2 X21.7

Not connected (* = marked no-connect by the designer): IC12 5(R2IN)* 6(R3IN)* 17(R3OUT)* 18(R2OUT)* 20(R2OUTB)* 21(INVALID#)*; IC13 20(R2OUTB)* 21(INVALID#)*; X21 2* 8* 10*; X22 10*

### Buses and harness runs
bus UART1_RS232[0..7]
bus UART2/3_RS232[0..7]
bus UART[0..16] = port UART[0..16]

### Notes on the sheet
- Title
- Size:
- Date:
- A3
- Number:
- Time:
- Revision:
- Sheet
- of
- File:
- (in symbol CON-JAE-MM70-314-310B1-314-0.5mm, part J) Apalis - UART; 10 of 25

### Library data of the parts
C122-C131 = C-X7R-100nF-16V-10%-0402: Capacitor Ceramic X7R 100nF 16V 10% 0402; Tolerance: 10%; Type: X7R; Value: 100nF
IC12 IC13 = IC-TI-SN65C3243DBR: RS-232 Serial Transceiver; Manufacturer Name: Texas Instruments; Manufacturer Part No.: SN65C3243DBR
JP3 = CON-Samtec-TSW-101-07-G-D: Header male, 1x2 Pins, 2.54 mm pitch; Manufacturer Name: Samtec; Pitch: 2.54 mm; No. of ways: 1x2; Manufacturer Part no.: TSW-101-07-G-D
R115 = R-0R-63mW-1%-0402: Resistor 0 ohm 63mW 1% 0402; Tolerance: 1%; Value: 0R; Rating: 63mW
R116 = R-100KR-63mW-5%-0402: as R43 on sheet RTC; Rating: 63mW; Tolerance: 5%
RA10 RA12 RA14 RA16 = RA-22R-63mW-5%-1206-div: Resistor Array 22 R 63mW 5% 1206; Tolerance: 5%; Power Dissipation: 63mW; Value: 22R
X1 = CON-JAE-MM70-314-310B1-314-0.5mm: as X1 on sheet RTC
X21 X22 = CON-Samtec-TSW-105-07-G-D: Header Male, 2x5 Pins, 2.54mm pitch; Manufacturer Name: Samtec; No. of. ways: 2x5; Pitch: 2.54mm; Manufacturer Part No.: TSW-105-07-G-D

## Sheet Extension.SchDoc: Ixora
size A3; Organization: Toradex AG; Address1: Altsagenstrasse 5; Address2: Horw; Address3: 6048; Address4: Switzerland; DocumentNumber: 19; Revision: V1.1; SheetNumber: 19; SheetTotal: 19; PageSetup: Record=PageOptions|CenterHorizontal=True|CenterVertical=True|PrintScale=0.73|XCorrection=1.00|YCorrection=1.00|PrintKind=0|BorderSize=5000000|LeftOffset=0|BottomOffset=0|Orientation=2|PaperLength=1000|PaperWidth=1000|Scale=100|PaperSource=7|PrintQuality=-4|MediaType=1|DitherType=10|PaperKind=A4|PrintScaleMode=1
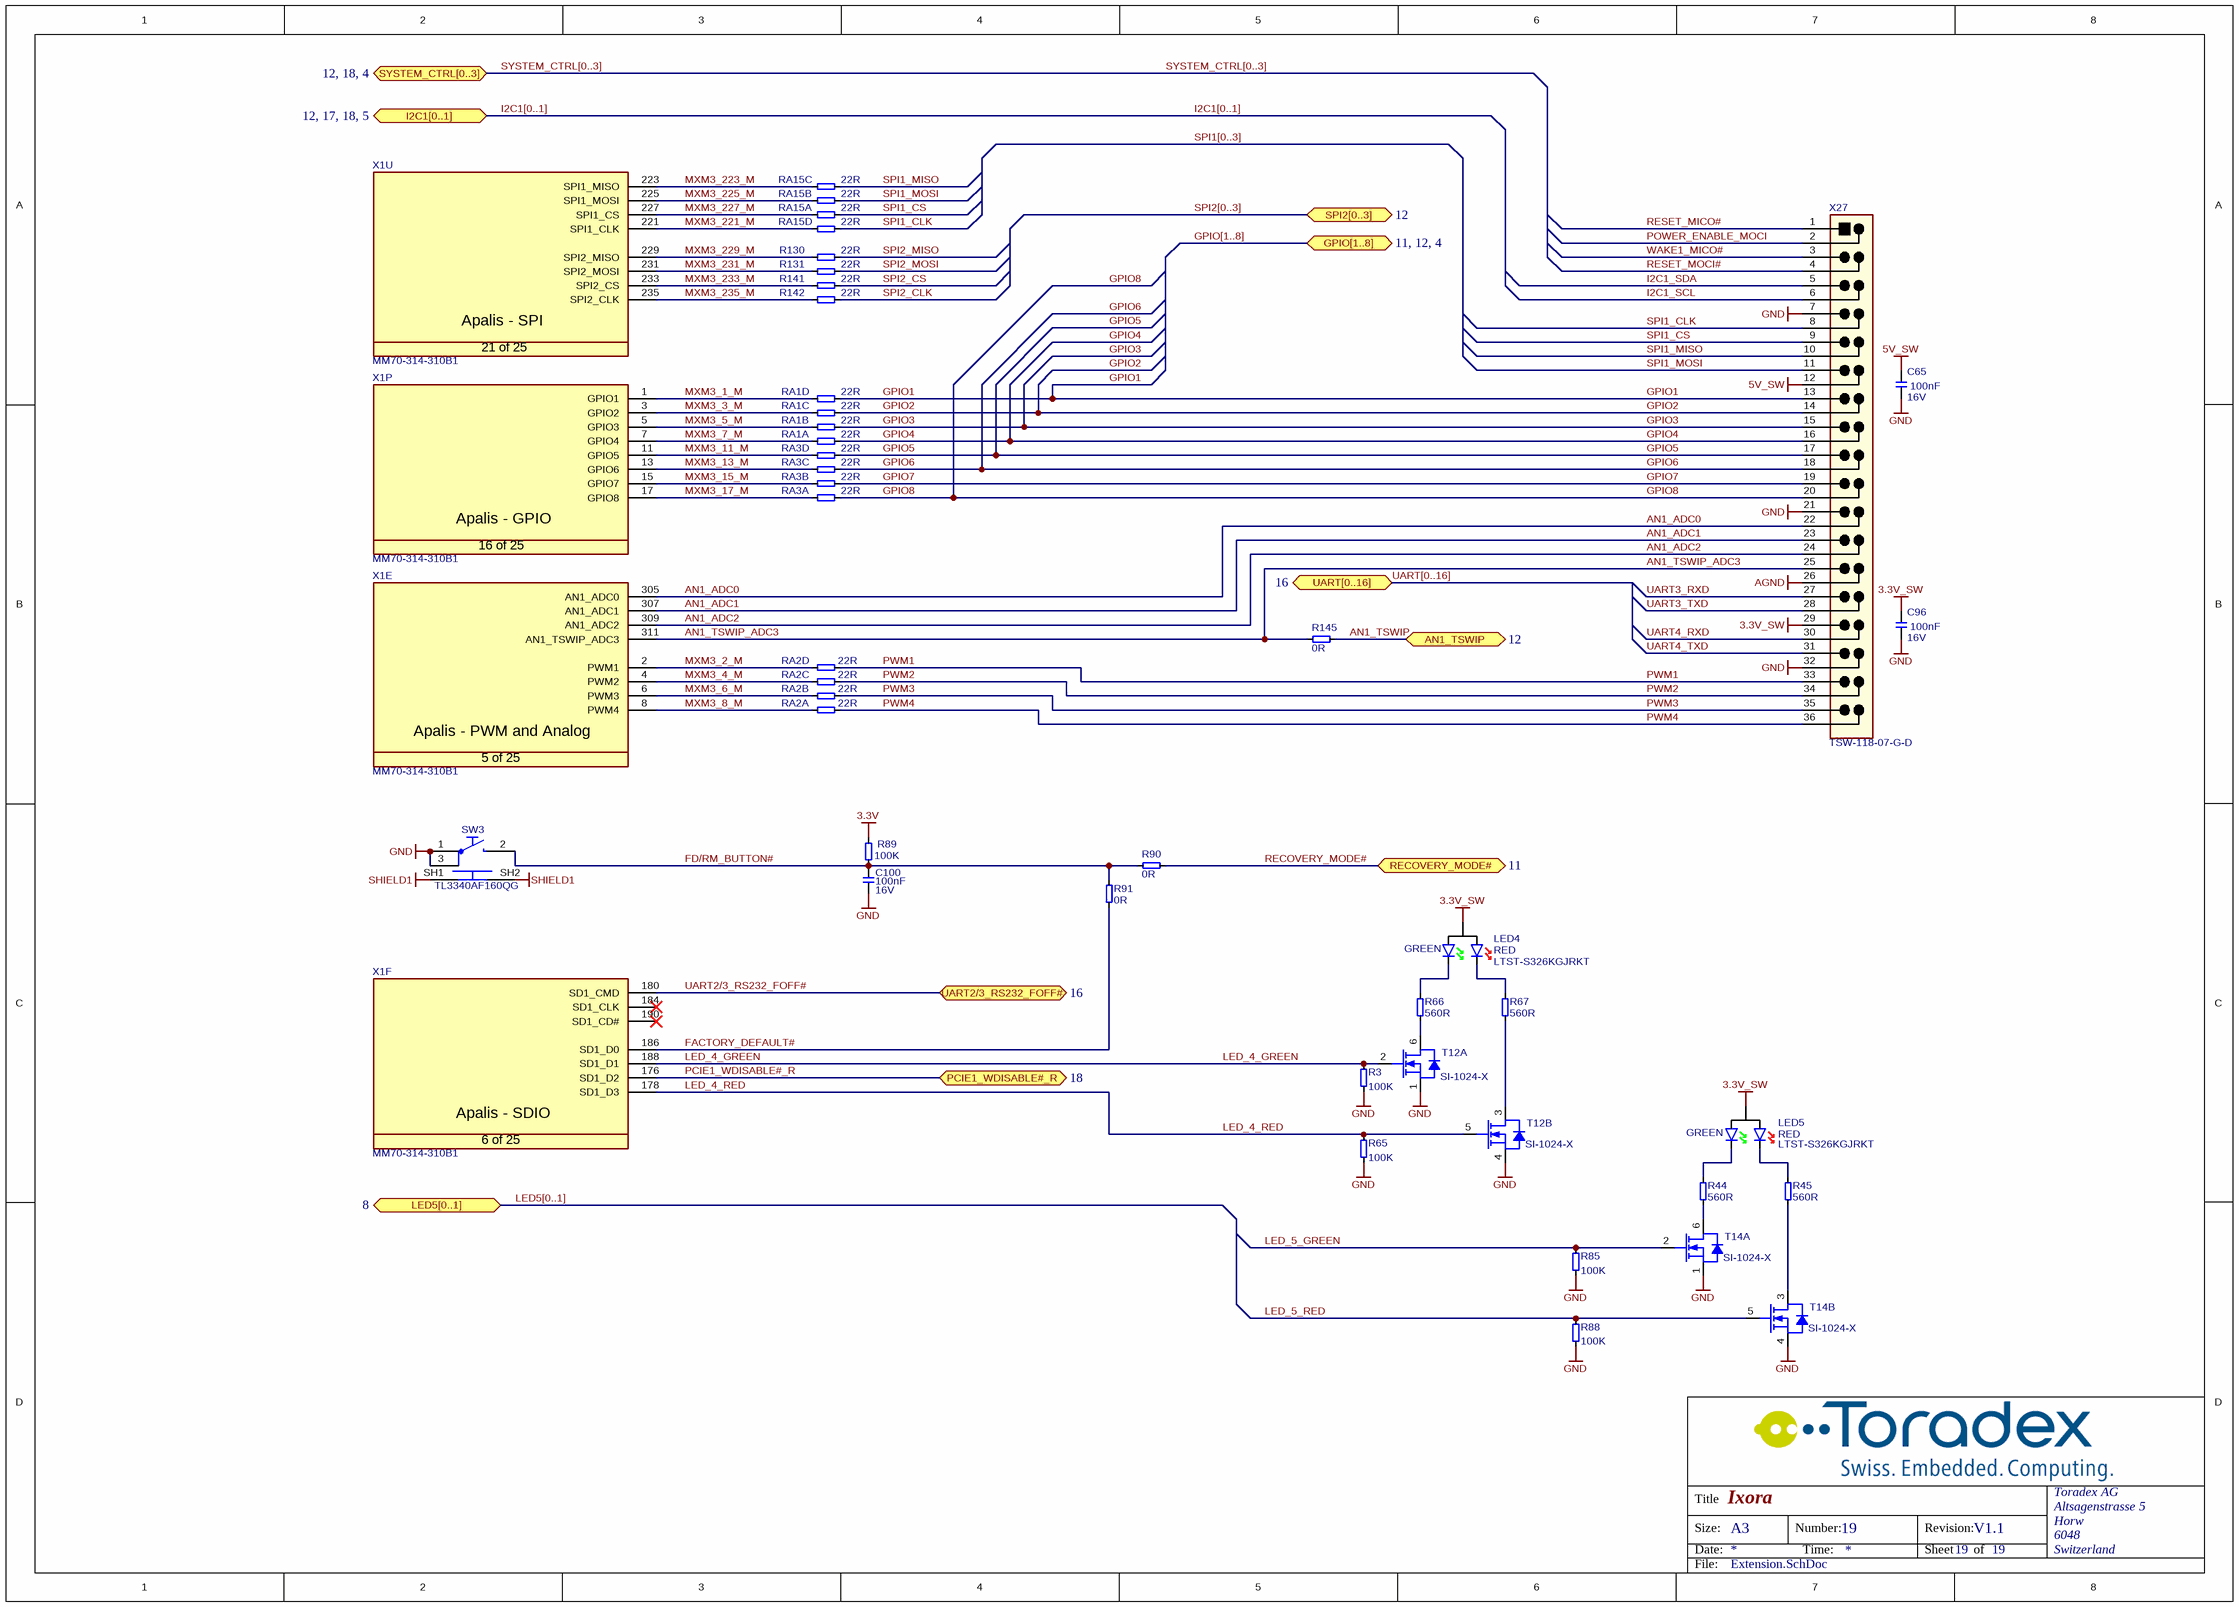
[diagram p12: Extension.SchDoc]

### Parts
C65  Rating: 16V  [CAPC1005X60N]  (hidden comment: 100nF)
C96  Rating: 16V  [CAPC1005X60N]  (hidden comment: 100nF)
C100  Rating: 16V  [CAPC1005X60N]  (hidden comment: 100nF)
LED4  Color1: GREEN  Color2: RED  [T_LiteON_LTST-S326KGJRKT]  (hidden comment: LTST-S326KGJRKT)
LED5  Color1: GREEN  Color2: RED  [T_LiteON_LTST-S326KGJRKT]  (hidden comment: LTST-S326KGJRKT)
R3  100K  [RESC1005X40N]
R44  560R  [RESC1005X40N]
R45  560R  [RESC1005X40N]
R65  100K  [RESC1005X40N]
R66  560R  [RESC1005X40N]
R67  560R  [RESC1005X40N]
R85  100K  [RESC1005X40N]
R88  100K  [RESC1005X40N]
R89  100K  [RESC1005X40N]
R90  0R  [T_RESC0603X30N]
R91  0R  [T_RESC0603X30N]
R130  22R  [RESC1005X40N]
R131  22R  [RESC1005X40N]
R141  22R  [RESC1005X40N]
R142  22R  [RESC1005X40N]
R145  0R  [RESC1005X40N]
RA1  22R  [T_Resistor_Array_X4]  (parts A,B,C,D of 4)
RA2  22R  [T_Resistor_Array_X4]  (parts A,B,C,D of 4)
RA3  22R  [T_Resistor_Array_X4]  (parts A,B,C,D of 4)
RA15  22R  [T_Resistor_Array_X4]  (parts A,B,C,D of 4)
SW3  TL3340AF160QG  [T_E-SWITCH- TL3340AF160QG]
T12  Manufacturer Part No.: SI-1024-X  [SOTFL50P160X60-6N]  (hidden comment: T-Vishay-SI-1024X-N)  (parts A,B of 2)
T14  Manufacturer Part No.: SI-1024-X  [SOTFL50P160X60-6N]  (hidden comment: T-Vishay-SI-1024X-N)  (parts A,B of 2)
X1  Manufacturer Part No.: MM70-314-310B1  [T_JAE_MM70-314-310B1]  (hidden comment: CON-JAE-MM70-314-310B1-314-0.5mm)  (parts E,F,P,U of 25)
X27  TSW-118-07-G-D  [T_SAMTEC_TSW-118-07-G-D]

### Ports
AN1_TSWIP (bidir, see 12), GPIO[1..8] (bidir, see 11, 12, 4), I2C1[0..1] (bidir, see 12, 17, 18, 5), LED5[0..1] (bidir, see 8), PCIE1_WDISABLE#_R (bidir, see 18), RECOVERY_MODE# (bidir, see 11), SPI2[0..3] (bidir, see 12), SYSTEM_CTRL[0..3] (bidir, see 12, 18, 4), UART2/3_RS232_FOFF# (bidir, see 16), UART[0..16] (bidir, see 16)

### Nets
3.3V: R89.1
3.3V_SW: C96.2 LED4.A LED5.A X27.29
5V_SW: C65.2 X27.12
AGND: X27.26
GND: C65.1 C96.1 C100.1 R3.2 R65.2 R85.2 R88.2 SW3.1 SW3.3 T12.1(S) T12.4(S) T14.1(S) T14.4(S) X27.7 X27.21 X27.32
SHIELD1: SW3.SH1 SW3.SH2
AN1_ADC0: X1.305(AN1_ADC0) X27.22
AN1_ADC1: X1.307(AN1_ADC1) X27.23
AN1_ADC2: X1.309(AN1_ADC2) X27.24
AN1_TSWIP: R145.2 ; port AN1_TSWIP
AN1_TSWIP_ADC3: R145.1 X1.311(AN1_TSWIP_ADC3) X27.25
FACTORY_DEFAULT#: R91.1 X1.186(SD1_D0)
FD/RM_BUTTON#: C100.2 R89.2 R90.1 R91.2 SW3.2
GPIO1: RA1.8 X27.13
GPIO2: RA1.7 X27.14
GPIO3: RA1.6 X27.15
GPIO4: RA1.5 X27.16
GPIO5: RA3.8 X27.17
GPIO6: RA3.7 X27.18
GPIO7: RA3.6 X27.19
GPIO8: RA3.5 X27.20
I2C1_SCL: X27.6
I2C1_SDA: X27.5
LED_4_GREEN: R3.1 T12.2(G) X1.188(SD1_D1)
LED_4_RED: R65.1 T12.5(G) X1.178(SD1_D3)
LED_5_GREEN: R85.1 T14.2(G)
LED_5_RED: R88.1 T14.5(G)
MXM3_1_M: RA1.4 X1.1(GPIO1)
MXM3_2_M: RA2.8 X1.2(PWM1)
MXM3_3_M: RA1.3 X1.3(GPIO2)
MXM3_4_M: RA2.7 X1.4(PWM2)
MXM3_5_M: RA1.2 X1.5(GPIO3)
MXM3_6_M: RA2.6 X1.6(PWM3)
MXM3_7_M: RA1.1 X1.7(GPIO4)
MXM3_8_M: RA2.5 X1.8(PWM4)
MXM3_11_M: RA3.4 X1.11(GPIO5)
MXM3_13_M: RA3.3 X1.13(GPIO6)
MXM3_15_M: RA3.2 X1.15(GPIO7)
MXM3_17_M: RA3.1 X1.17(GPIO8)
MXM3_221_M: RA15.4 X1.221(SPI1_CLK)
MXM3_223_M: RA15.3 X1.223(SPI1_MISO)
MXM3_225_M: RA15.2 X1.225(SPI1_MOSI)
MXM3_227_M: RA15.1 X1.227(SPI1_CS)
MXM3_229_M: R130.2 X1.229(SPI2_MISO)
MXM3_231_M: R131.2 X1.231(SPI2_MOSI)
MXM3_233_M: R141.2 X1.233(SPI2_CS)
MXM3_235_M: R142.2 X1.235(SPI2_CLK)
PCIE1_WDISABLE#_R: X1.176(SD1_D2) ; port PCIE1_WDISABLE#_R
POWER_ENABLE_MOCI: X27.2
PWM1: RA2.4 X27.33
PWM2: RA2.3 X27.34
PWM3: RA2.2 X27.35
PWM4: RA2.1 X27.36
RECOVERY_MODE#: R90.2 ; port RECOVERY_MODE#
RESET_MICO#: X27.1
RESET_MOCI#: X27.4
SPI1_CLK: RA15.8 X27.8
SPI1_CS: RA15.5 X27.9
SPI1_MISO: RA15.7 X27.10
SPI1_MOSI: RA15.6 X27.11
SPI2_CLK: R142.1
SPI2_CS: R141.1
SPI2_MISO: R130.1
SPI2_MOSI: R131.1
UART2/3_RS232_FOFF#: X1.180(SD1_CMD) ; port UART2/3_RS232_FOFF#
UART3_RXD: X27.27
UART3_TXD: X27.28
UART4_RXD: X27.30
UART4_TXD: X27.31
WAKE1_MICO#: X27.3
NetLED4_C1: LED4.C1 R67.2
NetLED4_C2: LED4.C2 R66.2
NetLED5_C1: LED5.C1 R45.1
NetLED5_C2: LED5.C2 R44.1
NetR44_2: R44.2 T14.6(D)
NetR45_2: R45.2 T14.3(D)
NetR66_1: R66.1 T12.6(D)
NetR67_1: R67.1 T12.3(D)

Not connected (* = marked no-connect by the designer): X1 184(SD1_CLK)* 190(SD1_CD#)*

### Buses and harness runs
bus GPIO[1..8] = port GPIO[1..8]
bus I2C1[0..1] = port I2C1[0..1]
bus LED5[0..1] = port LED5[0..1]
bus SPI1[0..3]
bus SPI2[0..3] = port SPI2[0..3]
bus SYSTEM_CTRL[0..3] = port SYSTEM_CTRL[0..3]
bus UART[0..16] = port UART[0..16]

### Notes on the sheet
- Title
- Size:
- Date:
- A3
- Number:
- Time:
- Revision:
- Sheet
- of
- File:
- (in symbol CON-JAE-MM70-314-310B1-314-0.5mm, part E) Apalis - PWM and Analog; 5 of 25
- (in symbol CON-JAE-MM70-314-310B1-314-0.5mm, part F) Apalis - SDIO; 6 of 25
- (in symbol CON-JAE-MM70-314-310B1-314-0.5mm, part P) Apalis - GPIO; 16 of 25
- (in symbol CON-JAE-MM70-314-310B1-314-0.5mm, part U) Apalis - SPI; 21 of 25

### Library data of the parts
C65 C96 C100 = C-X7R-100nF-16V-10%-0402: Capacitor Ceramic X7R 100nF 16V 10% 0402; Tolerance: 10%; Type: X7R; Value: 100nF
LED4 LED5 = LED-LiteON-LTST-S326KGJRKT: LED Green Red LiteON LTST-S326KGJRKT; Manufacturer Name: LiteON; Manufacturer Part No.: LTST-S326KGJRKT
R3 R65 R85 R88 R89 = R-100KR-63mW-5%-0402: as R43 on sheet RTC; Rating: 63mW; Tolerance: 5%
R44 R45 R66 R67 = R-560R-63mW-5%-0402: Resistor 560 ohm 63mW 5% 0402; Rating: 63mW; Tolerance: 5%; Value: 560R
R90 R91 = R-0R-63mW-1%-0603: Resistor 0 ohm 63mW 1% 0603; Rating: 63mW; Tolerance: 1%; Value: 0R
R130 R131 R141 R142 = R-22R-63mW-5%-0402: Resistor 22 ohm 63mW 5% 0402; Rating: 63mW; Tolerance: 5%; Value: 22R
R145 = R-0R-63mW-1%-0402: Resistor 0 ohm 63mW 1% 0402; Rating: 63mW; Tolerance: 1%; Value: 0R
RA1-RA3 RA15 = RA-22R-63mW-5%-1206-div: Resistor Array 22 R 63mW 5% 1206; Tolerance: 5%; Power Dissipation: 63mW; Value: 22R
SW3 = SW-E-Switch-TL3340AF160QG: SWITCH TACT SUB MINI 160GF SMD Right Angle; Manufacturer Part No.: TL3340AF160QG; Manufacturer Name: E-Switch
T12 T14 = T-Vishay-SI-1024X-N: as T13 on sheet Sata
X1 = CON-JAE-MM70-314-310B1-314-0.5mm: as X1 on sheet RTC
X27 = CON-Samtec-TSW-118-07-G-D-Header: Header male, 2x18 Pins, 2.54 mm pitch; Manufacturer Name: Samtec; Pitch: 2.54 mm; No. of ways: 2x18; Manufacturer Part No.: TSW-118-07-G-D

## Sheet USB_Connectors.SchDoc: Ixora
size A3; Organization: Toradex AG; Address1: Altsagenstrasse 5; Address2: Horw; Address3: 6048; Address4: Switzerland; DocumentNumber: 7; Revision: V1.1; SheetNumber: 7; SheetTotal: 19; PageSetup: Record=PageOptions|CenterHorizontal=True|CenterVertical=True|PrintScale=0.71|XCorrection=1.00|YCorrection=1.00|PrintKind=0|BorderSize=5000000|LeftOffset=0|BottomOffset=0|Orientation=2|PaperLength=1000|PaperWidth=1000|Scale=100|PaperSource=7|PrintQuality=-4|MediaType=1|DitherType=10|PaperKind=A4|PrintScaleMode=1
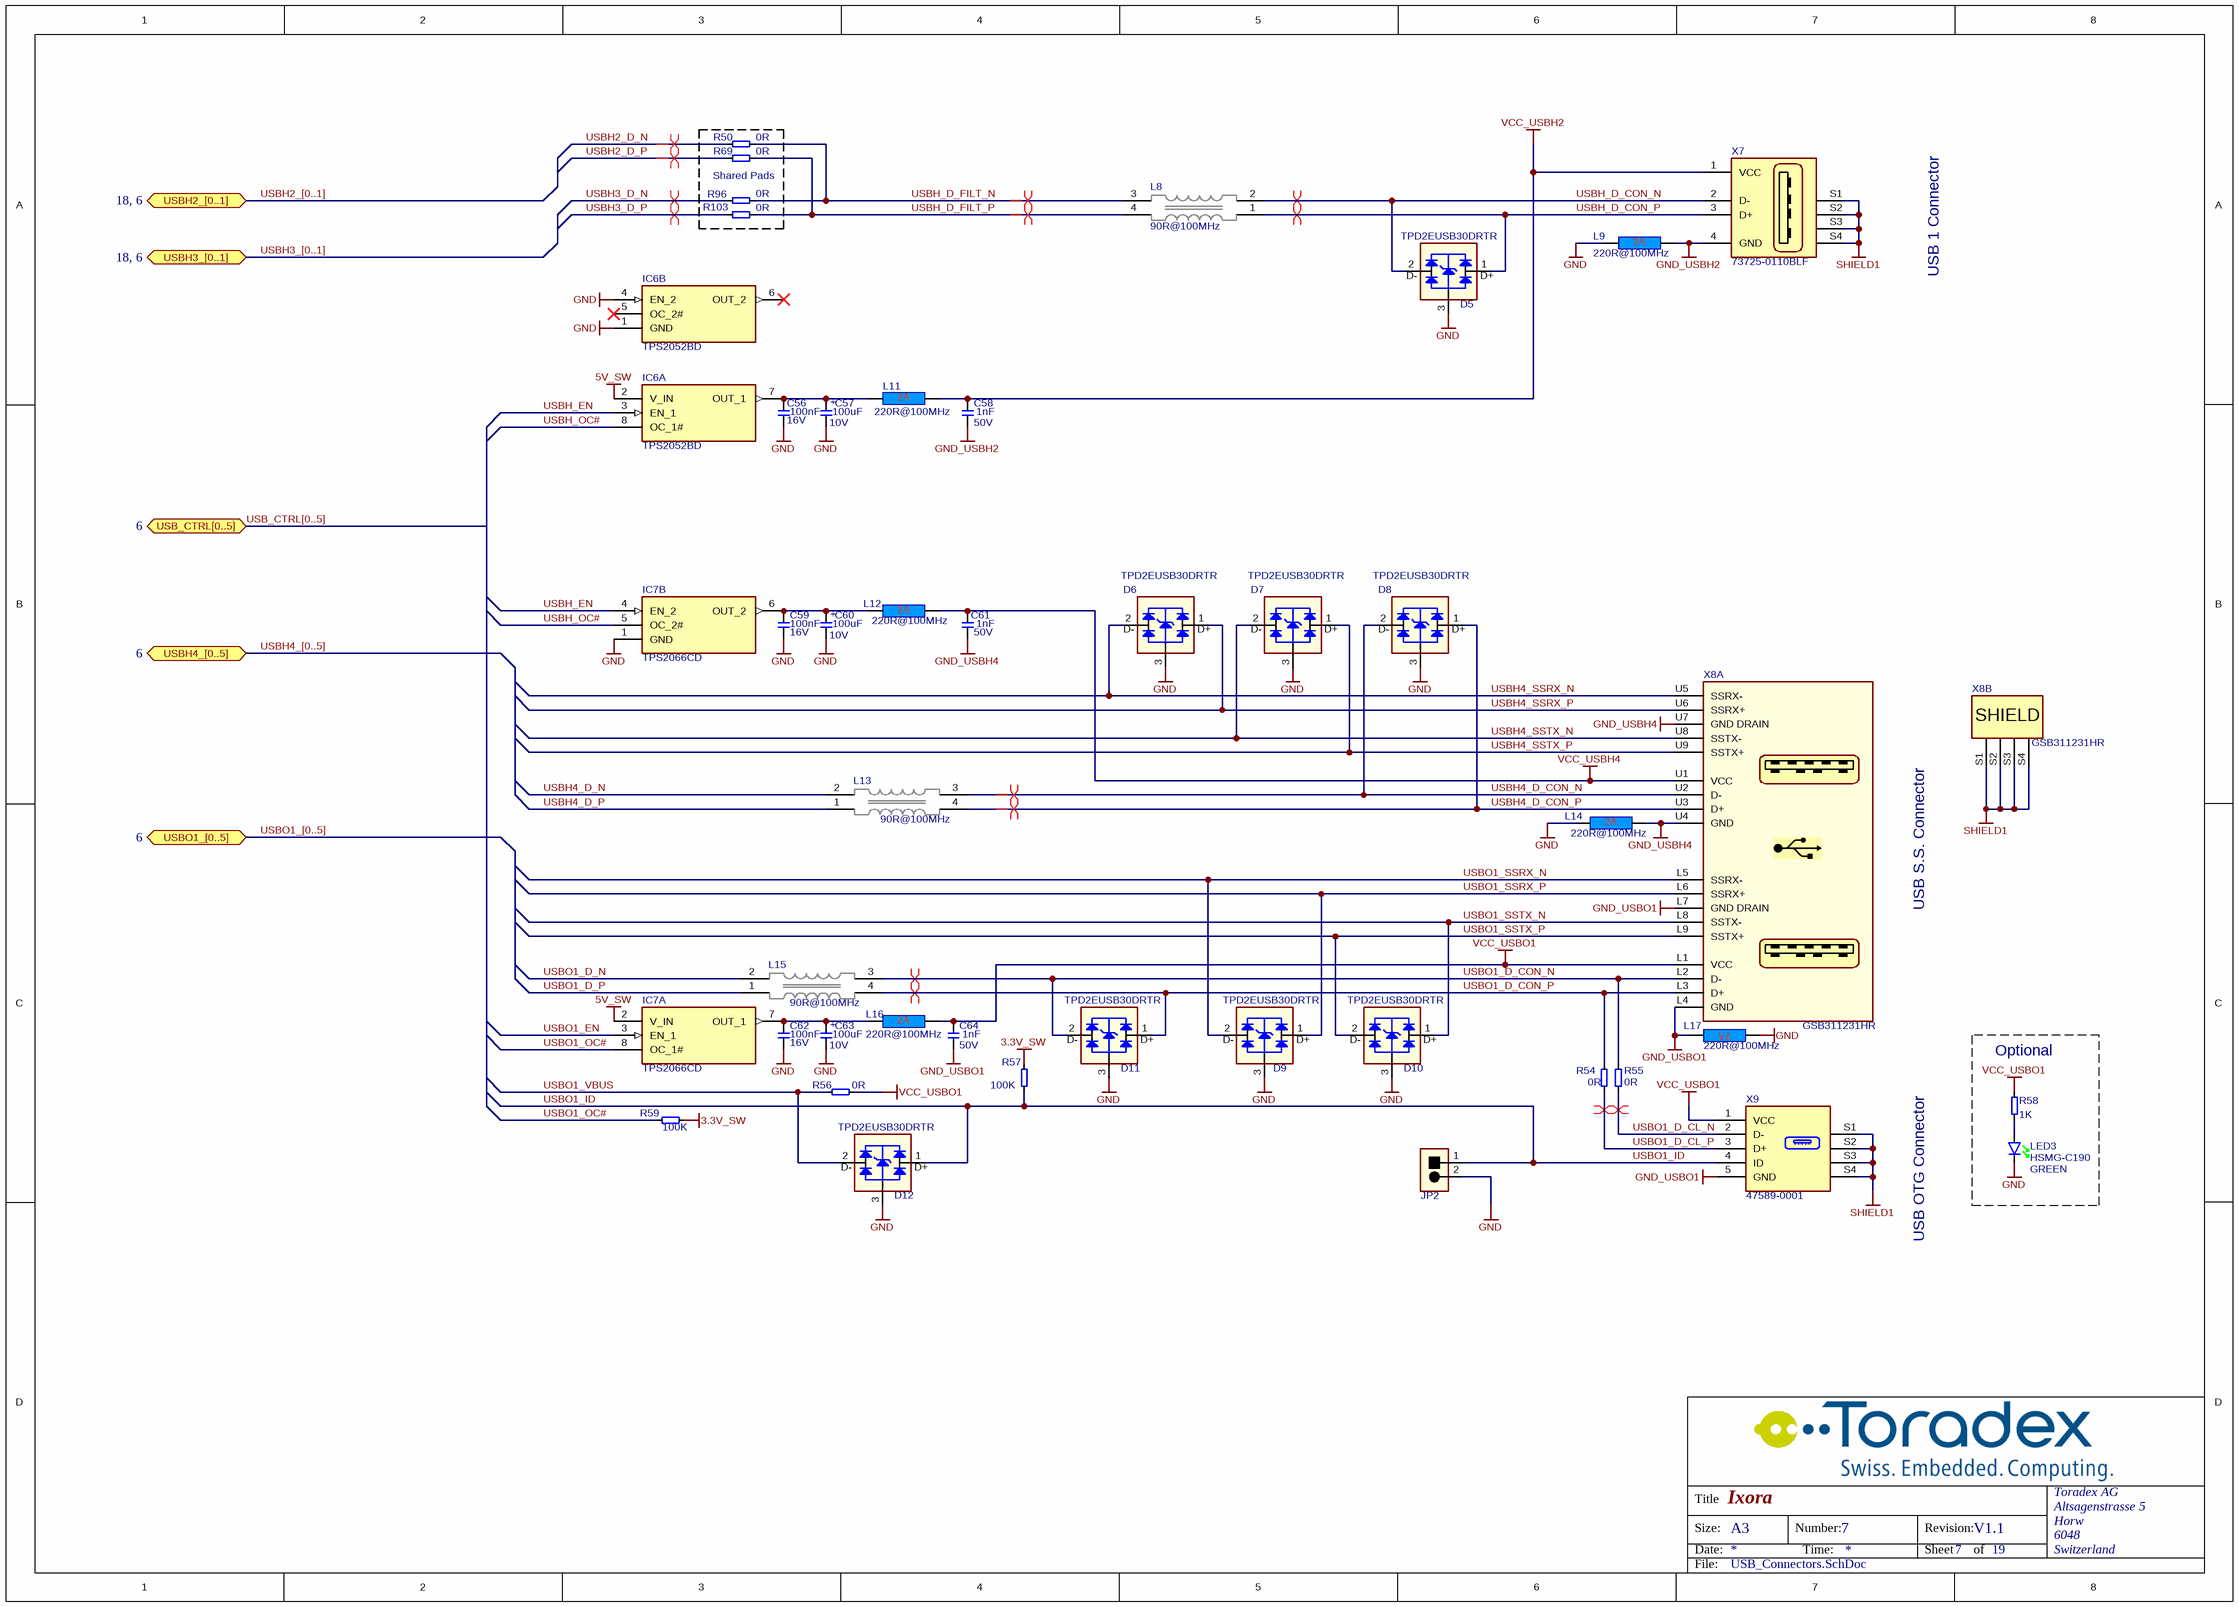
[diagram p13: USB_Connectors.SchDoc]

### Parts
C56  Rating: 16V  [CAPC1005X60N]  (hidden comment: 100nF)
C57  Rating: 10V  [CAPMP6032X280N]  (hidden comment: 100uF)
C58  Rating: 50V  [CAPC1005X60N]  (hidden comment: 1nF)
C59  Rating: 16V  [CAPC1005X60N]  (hidden comment: 100nF)
C60  Rating: 10V  [CAPMP6032X280N]  (hidden comment: 100uF)
C61  Rating: 50V  [CAPC1005X60N]  (hidden comment: 1nF)
C62  Rating: 16V  [CAPC1005X60N]  (hidden comment: 100nF)
C63  Rating: 10V  [CAPMP6032X280N]  (hidden comment: 100uF)
C64  Rating: 50V  [CAPC1005X60N]  (hidden comment: 1nF)
D5  TPD2EUSB30DRTR  [T_TI_TPD2EUSB30DRTR]
D6  TPD2EUSB30DRTR  [T_TI_TPD2EUSB30DRTR]
D7  TPD2EUSB30DRTR  [T_TI_TPD2EUSB30DRTR]
D8  TPD2EUSB30DRTR  [T_TI_TPD2EUSB30DRTR]
D9  TPD2EUSB30DRTR  [T_TI_TPD2EUSB30DRTR]
D10  TPD2EUSB30DRTR  [T_TI_TPD2EUSB30DRTR]
D11  TPD2EUSB30DRTR  [T_TI_TPD2EUSB30DRTR]
D12  TPD2EUSB30DRTR  [T_TI_TPD2EUSB30DRTR]
IC6  TPS2052BD  [SOIC127P600X173-8N]  (parts A,B of 2)
IC7  TPS2066CD  [SOIC127P600X173-8N]  (parts A,B of 2)
JP2  TSW-101-07-G-D  [T_Samtec_TSW-101-07-G-D]  (value not drawn)
L8  90R@100MHz  [T_Murata_DLW21SN900SQ2]
L9  220R@100MHz  [INDC1608X95N]
L11  220R@100MHz  [INDC1608X95N]
L12  220R@100MHz  [INDC1608X95N]
L13  90R@100MHz  [T_Murata_DLW21SN900SQ2]
L14  220R@100MHz  [INDC1608X95N]
L15  90R@100MHz  [T_Murata_DLW21SN900SQ2]
L16  220R@100MHz  [INDC1608X95N]
L17  220R@100MHz  [INDC1608X95N]
LED3  Manufacturer Part No.: HSMG-C190  Color: GREEN  [LEDC1608X80N_G]  (hidden comment: LED)
R50  0R  [T_RESC0603X30N]
R54  0R  [RESC1005X40N]
R55  0R  [RESC1005X40N]
R56  0R  [RESC1005X40N]
R57  100K  [RESC1005X40N]
R58  1K  [RESC1005X40N]
R59  100K  [RESC1005X40N]
R69  0R  [T_RESC0603X30N]
R96  0R  [T_RESC0603X30N]
R103  0R  [T_RESC0603X30N]
X7  Manufacturer Part No.: 73725-0110BLF  [T_FCI_73725-0110BLF]  (hidden comment: CON-Fci-73725-0110BLF)
X8  GSB311231HR  [T_AMPHENOL_ GSB311231HR]  (parts A,B of 2)
X9  Manufacturer Part No.: 47589-0001  [T_Molex_47589-0001]  (hidden comment: CON-Molex-47589-0001-5-0.65)

### Blocks framed on the sheet
Shared Pads: R50 R69 R96 R103
Optional: LED3 R58

### Ports
USB_CTRL[0..5] (bidir, see 6), USBH2_[0..1] (bidir, see 18, 6), USBH3_[0..1] (bidir, see 18, 6), USBH4_[0..5] (bidir, see 6), USBO1_[0..5] (bidir, see 6)

### Nets
3.3V_SW: R57.1 R59.2
5V_SW: IC6.2(V_IN) IC7.2(V_IN)
GND: C56.1 C57.2 C59.1 C60.2 C62.1 C63.2 D5.3 D6.3 D7.3 D8.3 D9.3 D10.3 D11.3 D12.3 IC6.1(GND) IC6.4(EN_2) IC7.1(GND) JP2.2 L9.1 L14.1 L17.1 LED3.1(K)
GND_USBH2: C58.1 L9.2 X7.4(GND)
GND_USBH4: C61.1 L14.2 X8.U4(GND) X8.U7(GND_DRAIN)
GND_USBO1: C64.1 L17.2 X8.L4(GND) X8.L7(GND_DRAIN) X9.5(GND)
SHIELD1: X7.S1 X7.S2 X7.S3 X7.S4 X8.S1(SHIELD) X8.S2(SHIELD) X8.S3(SHIELD) X8.S4(SHIELD) X9.S1 X9.S2 X9.S3 X9.S4
VCC_USBH2: C58.2 L11.2 X7.1(VCC)
VCC_USBH4: C61.2 L12.2 X8.U1(VCC)
VCC_USBO1: C64.2 L16.2 R56.2 R58.1 X8.L1(VCC) X9.1(VCC)
USBH2_D_N: R50.1
USBH2_D_P: R69.1
USBH3_D_N: R96.1
USBH3_D_P: R103.1
USBH4_D_CON_N: D8.2(D-) L13.3 X8.U2(D-)
USBH4_D_CON_P: D8.1(D+) L13.4 X8.U3(D+)
USBH4_D_N: L13.2
USBH4_D_P: L13.1
USBH4_SSRX_N: D6.2(D-) X8.U5(SSRX-)
USBH4_SSRX_P: D6.1(D+) X8.U6(SSRX+)
USBH4_SSTX_N: D7.2(D-) X8.U8(SSTX-)
USBH4_SSTX_P: D7.1(D+) X8.U9(SSTX+)
USBH_D_CON_N: D5.2(D-) L8.2 X7.2(D-)
USBH_D_CON_P: D5.1(D+) L8.1 X7.3(D+)
USBH_D_FILT_N: L8.3 R50.2 R96.2
USBH_D_FILT_P: L8.4 R69.2 R103.2
USBH_EN: IC6.3(EN_1) IC7.4(EN_2)
USBH_OC#: IC6.8(OC_1#) IC7.5(OC_2#)
USBO1_D_CL_N: R55.1 X9.2(D-)
USBO1_D_CL_P: R54.1 X9.3(D+)
USBO1_D_CON_N: D11.2(D-) L15.3 R55.2 X8.L2(D-)
USBO1_D_CON_P: D11.1(D+) L15.4 R54.2 X8.L3(D+)
USBO1_D_N: L15.2
USBO1_D_P: L15.1
USBO1_EN: IC7.3(EN_1)
USBO1_ID: D12.1(D+) JP2.1 R57.2 X9.4(ID)
USBO1_OC#: IC7.8(OC_1#) R59.1
USBO1_SSRX_N: D9.2(D-) X8.L5(SSRX-)
USBO1_SSRX_P: D9.1(D+) X8.L6(SSRX+)
USBO1_SSTX_N: D10.1(D+) X8.L8(SSTX-)
USBO1_SSTX_P: D10.2(D-) X8.L9(SSTX+)
USBO1_VBUS: D12.2(D-) R56.1
NetC56_2: C56.2 C57.1 IC6.7(OUT_1) L11.1
NetC59_2: C59.2 C60.1 IC7.6(OUT_2) L12.1
NetC62_2: C62.2 C63.1 IC7.7(OUT_1) L16.1
NetLED3_2: LED3.2(A) R58.2

Not connected (* = marked no-connect by the designer): IC6 5(OC_2#)* 6(OUT_2)*

### Buses and harness runs
bus USB_CTRL[0..5] = port USB_CTRL[0..5]
bus USBH2_[0..1] = port USBH2_[0..1]
bus USBH3_[0..1] = port USBH3_[0..1]
bus USBH4_[0..5] = port USBH4_[0..5]
bus USBO1_[0..5] = port USBO1_[0..5]

### Layout directives
differential pair: USBH2_D_N, USBH2_D_P, USBH3_D_N, USBH3_D_P, USBH4_D_CON_N, USBH4_D_CON_P, USBH_D_CON_N, USBH_D_CON_P, USBH_D_FILT_N, USBH_D_FILT_P, USBO1_D_CL_N, USBO1_D_CL_P, USBO1_D_CON_N, USBO1_D_CON_P

### Notes on the sheet
- USB 1 Connector
- USB S.S. Connector
- USB OTG Connector
- Title
- Size:
- Date:
- A3
- Number:
- Time:
- Revision:
- Sheet
- of
- File:
- (in symbol C-TA-100uF-10V-10%-6032) +

### Library data of the parts
C56 C59 C62 = C-X7R-100nF-16V-10%-0402: Capacitor Ceramic X7R 100nF 16V 10% 0402; Tolerance: 10%; Type: X7R; Value: 100nF
C57 C60 C63 = C-TA-100uF-10V-10%-6032: Capacitor TA 100uF 10V 10% 6032; Tolerance: 10%; Type: TA; Value: 100uF
C58 C61 C64 = C-X7R-1nF-50V-10%-0402: Capacitor Ceramic X7R 1nF 50V 10% 0402; Tolerance: 10%; Type: X7R; Value: 1nF
D5-D12 = D-TI-TPD2EUSB30DRTR: 2 Channel Protection for Super Speed USB3.0; Manufacturer Name: TI; Manufacturer Part No.: TPD2EUSB30DRTR
IC6 = IC-TI-TPS2052BD: Dual High Side Switch With OC_DET 500mA/CH; Manufacturer Name: Texas Instruments; Manufacturer Part No.: TPS2052BD
IC7 = IC-TI-TPS2066CD: 1A Dual High Side Switch (Current Limiting (Fixed), Over Temperature, Reverse Current, UVLO); Manufacturer Name: Texas Instruments; Manufacturer Part No.: TPS2066CD
JP2 = CON-Samtec-TSW-101-07-G-D: as JP3 on sheet Serial; No. of ways: 1x2; Manufacturer Part no.: TSW-101-07-G-D
L8 L13 L15 = L-Murata-DLW21SN900SQ2-90R@100MHz-330mA-25%: Common Mode Choke High Speed 90R 330mA; Manufacturer Name: Murata; Tolerance: 25%; Rating: 330mA; Manufacturer Part No.: DLW21SN900SQ2; Value: 90R@100MHz
L9 L11 L12 L14 L16 L17 = L-220R@100MHz-2A-25%-0603: as L19 on sheet SDCard; Rating: 2A; Value: 220R@100MHz
LED3 = LED-Avago-HSMG-C190: Surface mount LED green 20mA; Manufacturer Name: Avago
R50 R69 R96 R103 = R-0R-63mW-1%-0603: Resistor 0 ohm 63mW 1% 0603; Rating: 63mW; Tolerance: 1%; Value: 0R
R54-R56 = R-0R-63mW-1%-0402: Resistor 0 ohm 63mW 1% 0402; Rating: 63mW; Tolerance: 1%; Value: 0R
R57 R59 = R-100KR-63mW-5%-0402: as R43 on sheet RTC; Rating: 63mW; Tolerance: 5%
R58 = R-1KR-63mW-5%-0402: Resistor 1 Kohm 63mW 5% 0402; Rating: 63mW; Tolerance: 5%; Value: 1K
X7 = CON-Fci-73725-0110BLF: USB Type A Connector; Manufacturer Name: FCI; No. of ways: 4
X8 = CON-Amphenol-GSB311231HR: USB 3.0 double row, Type A; No. of ways: 18; Manufacturer Name: Amphenol; Manufacturer Part No.: GSB311231HR
X9 = CON-Molex-47589-0001-5-0.65: Micro USB OTG Connector; Manufacturer Name: Molex; No. of ways: 5

## Sheet USB.SchDoc: Ixora
size A3; Organization: Toradex AG; Address1: Altsagenstrasse 5; Address2: Horw; Address3: 6048; Address4: Switzerland; DocumentNumber: 6; Revision: V1.1; SheetNumber: 6; SheetTotal: 19; PageSetup: Record=PageOptions|CenterHorizontal=True|CenterVertical=True|PrintScale=0.73|XCorrection=1.00|YCorrection=1.00|PrintKind=0|BorderSize=5000000|LeftOffset=0|BottomOffset=0|Orientation=2|PaperLength=1000|PaperWidth=1000|Scale=100|PaperSource=7|PrintQuality=-4|MediaType=1|DitherType=10|PaperKind=A4|PrintScaleMode=1
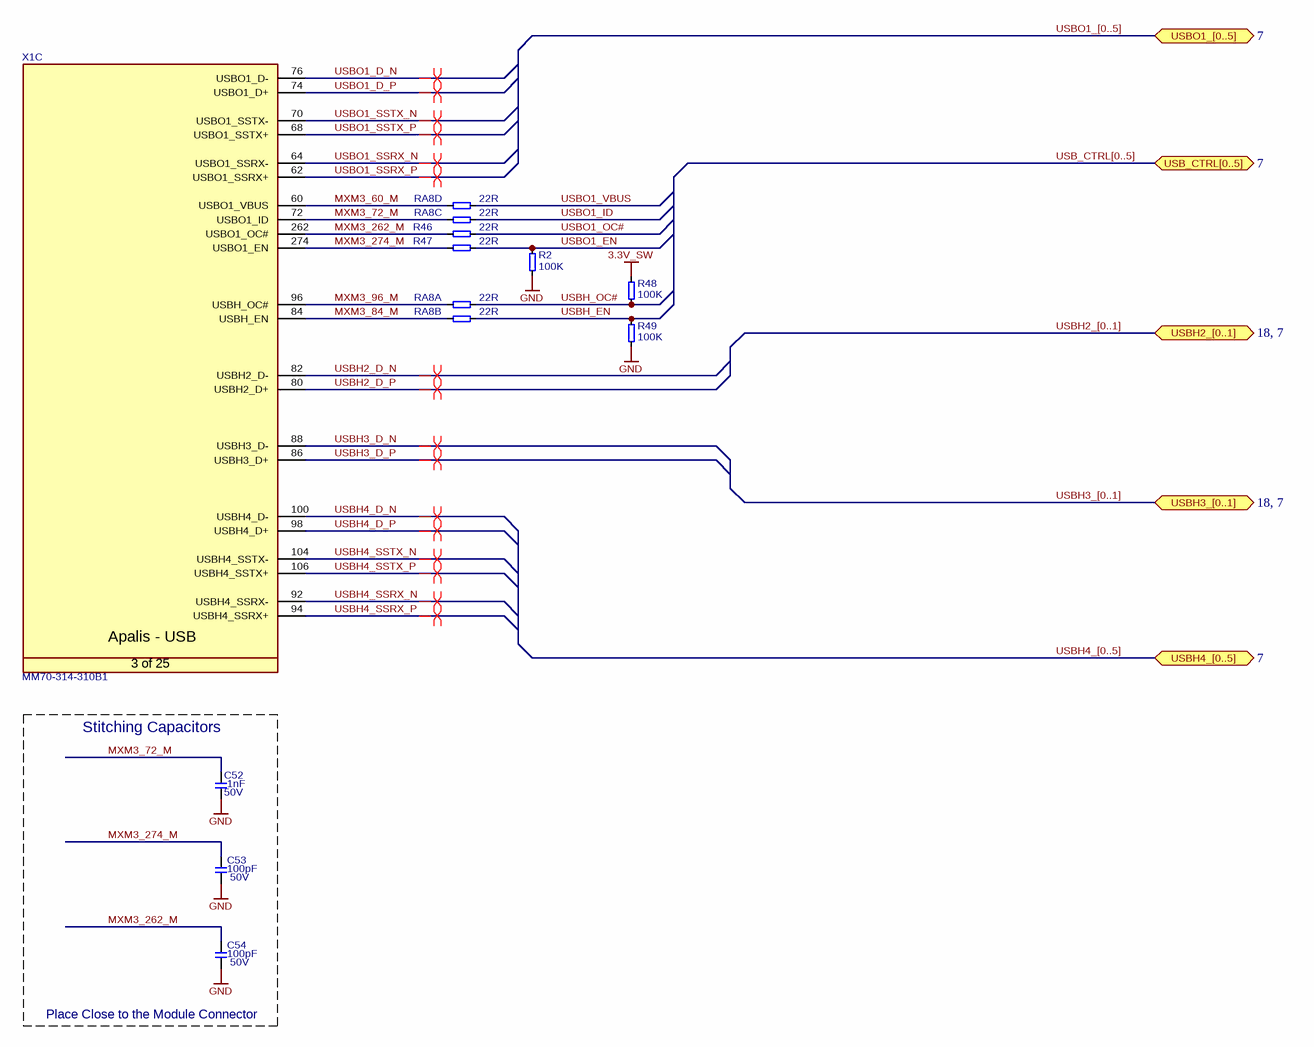
[diagram p14: USB.SchDoc]

### Parts
C52  Rating: 50V  [CAPC1005X60N]  (hidden comment: 1nF)
C53  Rating: 50V  [CAPC1005X60N]  (hidden comment: 100pF)
C54  Rating: 50V  [CAPC1005X60N]  (hidden comment: 100pF)
R2  100K  [RESC1005X40N]
R46  22R  [RESC1005X40N]
R47  22R  [RESC1005X40N]
R48  100K  [RESC1005X40N]
R49  100K  [RESC1005X40N]
RA8  22R  [T_Resistor_Array_X4]  (parts A,B,C,D of 4)
X1  Manufacturer Part No.: MM70-314-310B1  [T_JAE_MM70-314-310B1]  (hidden comment: CON-JAE-MM70-314-310B1-314-0.5mm)  (part C of 25)

### Blocks framed on the sheet
Stitching Capacitors: C52-C54

### Ports
USB_CTRL[0..5] (bidir, see 7), USBH2_[0..1] (bidir, see 18, 7), USBH3_[0..1] (bidir, see 18, 7), USBH4_[0..5] (bidir, see 7), USBO1_[0..5] (bidir, see 7)

### Nets
3.3V_SW: R48.1
GND: C52.1 C53.1 C54.1 R2.1 R49.1
MXM3_60_M: RA8.4 X1.60(USBO1_VBUS)
MXM3_72_M: C52.2 RA8.3 X1.72(USBO1_ID)
MXM3_84_M: RA8.2 X1.84(USBH_EN)
MXM3_96_M: RA8.1 X1.96(USBH_OC#)
MXM3_262_M: C54.2 R46.1 X1.262(USBO1_OC#)
MXM3_274_M: C53.2 R47.1 X1.274(USBO1_EN)
USBH2_D_N: X1.82(USBH2_D-)
USBH2_D_P: X1.80(USBH2_D+)
USBH3_D_N: X1.88(USBH3_D-)
USBH3_D_P: X1.86(USBH3_D+)
USBH4_D_N: X1.100(USBH4_D-)
USBH4_D_P: X1.98(USBH4_D+)
USBH4_SSRX_N: X1.92(USBH4_SSRX-)
USBH4_SSRX_P: X1.94(USBH4_SSRX+)
USBH4_SSTX_N: X1.104(USBH4_SSTX-)
USBH4_SSTX_P: X1.106(USBH4_SSTX+)
USBH_EN: R49.2 RA8.6
USBH_OC#: R48.2 RA8.5
USBO1_D_N: X1.76(USBO1_D-)
USBO1_D_P: X1.74(USBO1_D+)
USBO1_EN: R2.2 R47.2
USBO1_ID: RA8.7
USBO1_OC#: R46.2
USBO1_SSRX_N: X1.64(USBO1_SSRX-)
USBO1_SSRX_P: X1.62(USBO1_SSRX+)
USBO1_SSTX_N: X1.70(USBO1_SSTX-)
USBO1_SSTX_P: X1.68(USBO1_SSTX+)
USBO1_VBUS: RA8.8

### Buses and harness runs
bus USB_CTRL[0..5] = port USB_CTRL[0..5]
bus USBH2_[0..1] = port USBH2_[0..1]
bus USBH3_[0..1] = port USBH3_[0..1]
bus USBH4_[0..5] = port USBH4_[0..5]
bus USBO1_[0..5] = port USBO1_[0..5]

### Layout directives
differential pair: USBH2_D_N, USBH2_D_P, USBH3_D_N, USBH3_D_P, USBH4_D_N, USBH4_D_P, USBH4_SSRX_N, USBH4_SSRX_P, USBH4_SSTX_N, USBH4_SSTX_P, USBO1_D_N, USBO1_D_P, USBO1_SSRX_N, USBO1_SSRX_P, USBO1_SSTX_N, USBO1_SSTX_P

### Notes on the sheet
- (near C54) Place Close to the Module Connector
- Title
- Size:
- Date:
- A3
- Number:
- Time:
- Revision:
- Sheet
- of
- File:
- (in symbol CON-JAE-MM70-314-310B1-314-0.5mm, part C) Apalis - USB; 3 of 25

### Library data of the parts
C52 = C-X7R-1nF-50V-10%-0402: Capacitor Ceramic X7R 1nF 50V 10% 0402; Tolerance: 10%; Type: X7R; Value: 1nF
C53 C54 = C-X7R-100pF-50V-10%-0402: Capacitor Ceramic X7R 100pF 50V 10% 0402; Tolerance: 10%; Type: X7R; Value: 100pF
R2 R48 R49 = R-100KR-63mW-5%-0402: as R43 on sheet RTC; Rating: 63mW; Tolerance: 5%
R46 R47 = R-22R-63mW-5%-0402: Resistor 22 ohm 63mW 5% 0402; Rating: 63mW; Tolerance: 5%; Value: 22R
RA8 = RA-22R-63mW-5%-1206-div: Resistor Array 22 R 63mW 5% 1206; Tolerance: 5%; Power Dissipation: 63mW; Value: 22R
X1 = CON-JAE-MM70-314-310B1-314-0.5mm: as X1 on sheet RTC

## Sheet Revision_History.SchDoc: Ixora
size A3; Organization: Toradex AG; Address1: Altsagenstrasse 5; Address2: Horw; Address3: 6048; Address4: Switzerland; DocumentNumber: 1; Revision: V1.1; SheetNumber: 1; SheetTotal: 19; PageSetup: Record=PageOptions|CenterHorizontal=True|CenterVertical=True|PrintScale=0.73|XCorrection=1.00|YCorrection=1.00|PrintKind=0|BorderSize=5000000|LeftOffset=0|BottomOffset=0|Orientation=2|PaperLength=1000|PaperWidth=1000|Scale=100|PaperSource=7|PrintQuality=-4|MediaType=1|DitherType=10|PaperKind=A4|PrintScaleMode=1
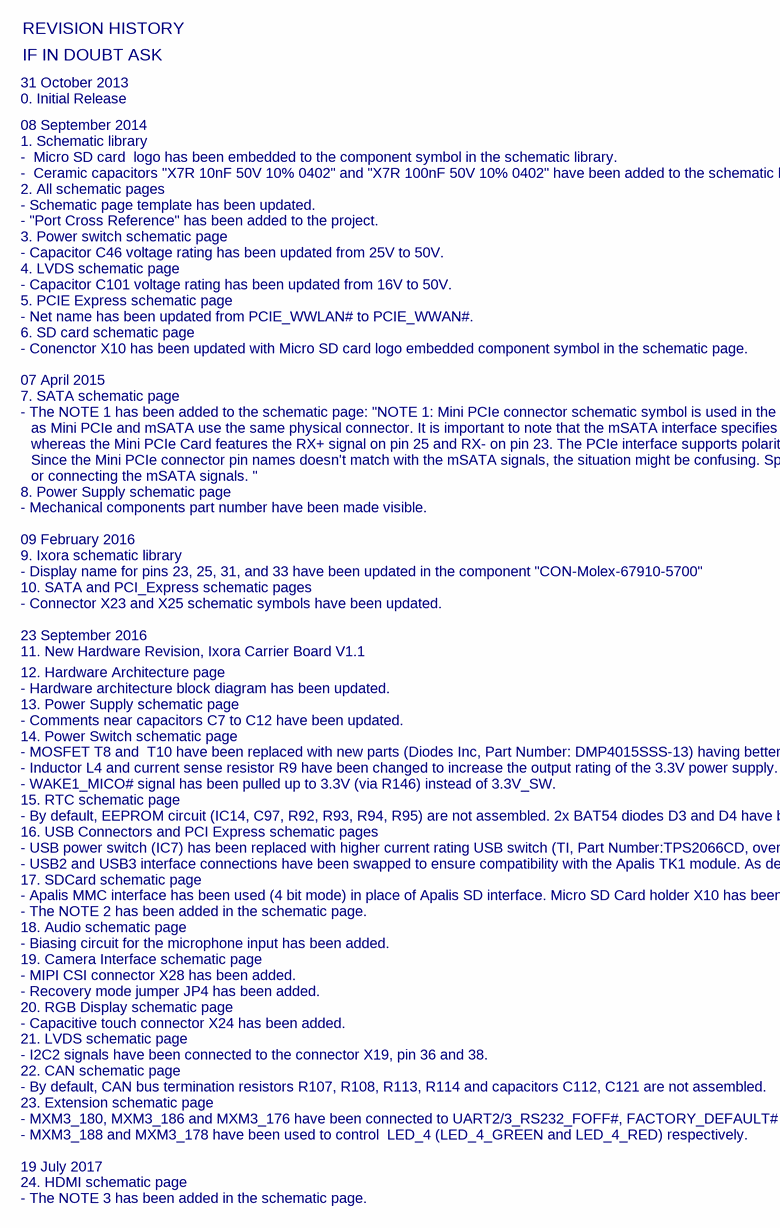
[diagram p15: Revision_History.SchDoc]

### Notes on the sheet
- REVISION HISTORY
- IF IN DOUBT ASK
- 31 October 2013
- 0. Initial Release
- 08 September 2014
- 1. Schematic library
- 2. All schematic pages
- - Schematic page template has been updated.
- -  Micro SD card  logo has been embedded to the component symbol in the schematic library.
- -  Ceramic capacitors "X7R 10nF 50V 10% 0402" and "X7R 100nF 50V 10% 0402" have been added to the schematic library.
- - "Port Cross Reference" has been added to the project.
- - Capacitor C46 voltage rating has been updated from 25V to 50V.
- 3. Power switch schematic page
- 4. LVDS schematic page
- - Capacitor C101 voltage rating has been updated from 16V to 50V.
- - Net name has been updated from PCIE_WWLAN# to PCIE_WWAN#.
- 5. PCIE Express schematic page
- - Conenctor X10 has been updated with Micro SD card logo embedded component symbol in the schematic page.
- 6. SD card schematic page
- 07 April 2015
- - The NOTE 1 has been added to the schematic page: "NOTE 1: Mini PCIe connector schematic symbol is used in the schematic for the mSATA connector (X23),
- 7. SATA schematic page
- as Mini PCIe and mSATA use the same physical connector. It is important to note that the mSATA interface specifies the RX+ signal on pin 23 and RX- signal on pin 25,
- whereas the Mini PCIe Card features the RX+ signal on pin 25 and RX- on pin 23. The PCIe interface supports polarity reversal, but not the SATA interface.
- Since the Mini PCIe connector pin names doesn't match with the mSATA signals, the situation might be confusing. Special attention must be paid while reading
- or connecting the mSATA signals. "
- - Mechanical components part number have been made visible.
- 8. Power Supply schematic page
- 09 February 2016
- - Display name for pins 23, 25, 31, and 33 have been updated in the component "CON-Molex-67910-5700"
- 9. Ixora schematic library
- - Connector X23 and X25 schematic symbols have been updated.
- 10. SATA and PCI_Express schematic pages
- 23 September 2016
- 11. New Hardware Revision, Ixora Carrier Board V1.1
- 12. Hardware Architecture page
- 14. Power Switch schematic page
- - MOSFET T8 and  T10 have been replaced with new parts (Diodes Inc, Part Number: DMP4015SSS-13) having better Vgs rating. Zener diodes (On Semi, Part Number: MM3Z20VT1G) D14 and D16 have been added for MOSFETs gate protection.
- - Hardware architecture block diagram has been updated.
- 13. Power Supply schematic page
- - Comments near capacitors C7 to C12 have been updated.
- 15. RTC schematic page
- - By default, EEPROM circuit (IC14, C97, R92, R93, R94, R95) are not assembled. 2x BAT54 diodes D3 and D4 have been replaced with single BAT54C diode D3.
- - Inductor L4 and current sense resistor R9 have been changed to increase the output rating of the 3.3V power supply.
- - WAKE1_MICO# signal has been pulled up to 3.3V (via R146) instead of 3.3V_SW.
- 16. USB Connectors and PCI Express schematic pages
- - USB power switch (IC7) has been replaced with higher current rating USB switch (TI, Part Number:TPS2066CD, overcurrent limit 1A).
- 17. SDCard schematic page
- - USB2 and USB3 interface connections have been swapped to ensure compatibility with the Apalis TK1 module. As default assembly, USB2 has been connected to the PCIe connector and USB3 has been connected to the connector X7 (USB 1 connector).
- - Apalis MMC interface has been used (4 bit mode) in place of Apalis SD interface. Micro SD Card holder X10 has been replaced with new connector (Wurth, Part Number: 693071010811).
- 18. Audio schematic page
- - Biasing circuit for the microphone input has been added.
- - The NOTE 2 has been added in the schematic page.
- 19. Camera Interface schematic page
- - MIPI CSI connector X28 has been added.
- 20. RGB Display schematic page
- - Capacitive touch connector X24 has been added.
- - Recovery mode jumper JP4 has been added.
- 21. LVDS schematic page
- - I2C2 signals have been connected to the connector X19, pin 36 and 38.
- 22. CAN schematic page
- - By default, CAN bus termination resistors R107, R108, R113, R114 and capacitors C112, C121 are not assembled.
- 23. Extension schematic page
- - MXM3_180, MXM3_186 and MXM3_176 have been connected to UART2/3_RS232_FOFF#, FACTORY_DEFAULT# and PCIE_WDISABLE#_R signals respectively.
- - MXM3_188 and MXM3_178 have been used to control  LED_4 (LED_4_GREEN and LED_4_RED) respectively.
- 19 July 2017
- - The NOTE 3 has been added in the schematic page.
- 24. HDMI schematic page
- Title
- Size:
- Date:
- A3
- Number:
- Time:
- Revision:
- Sheet
- of
- File: